# Altium project PCB_Concentrator.PrjPcb (part 2 of 3)

## Sheet 05_Inputs_28-35.SchDoc
size 594 x 420 mm; DocumentNumber: Входы сухой контакт; SheetNumber: 5; SheetTotal: 6
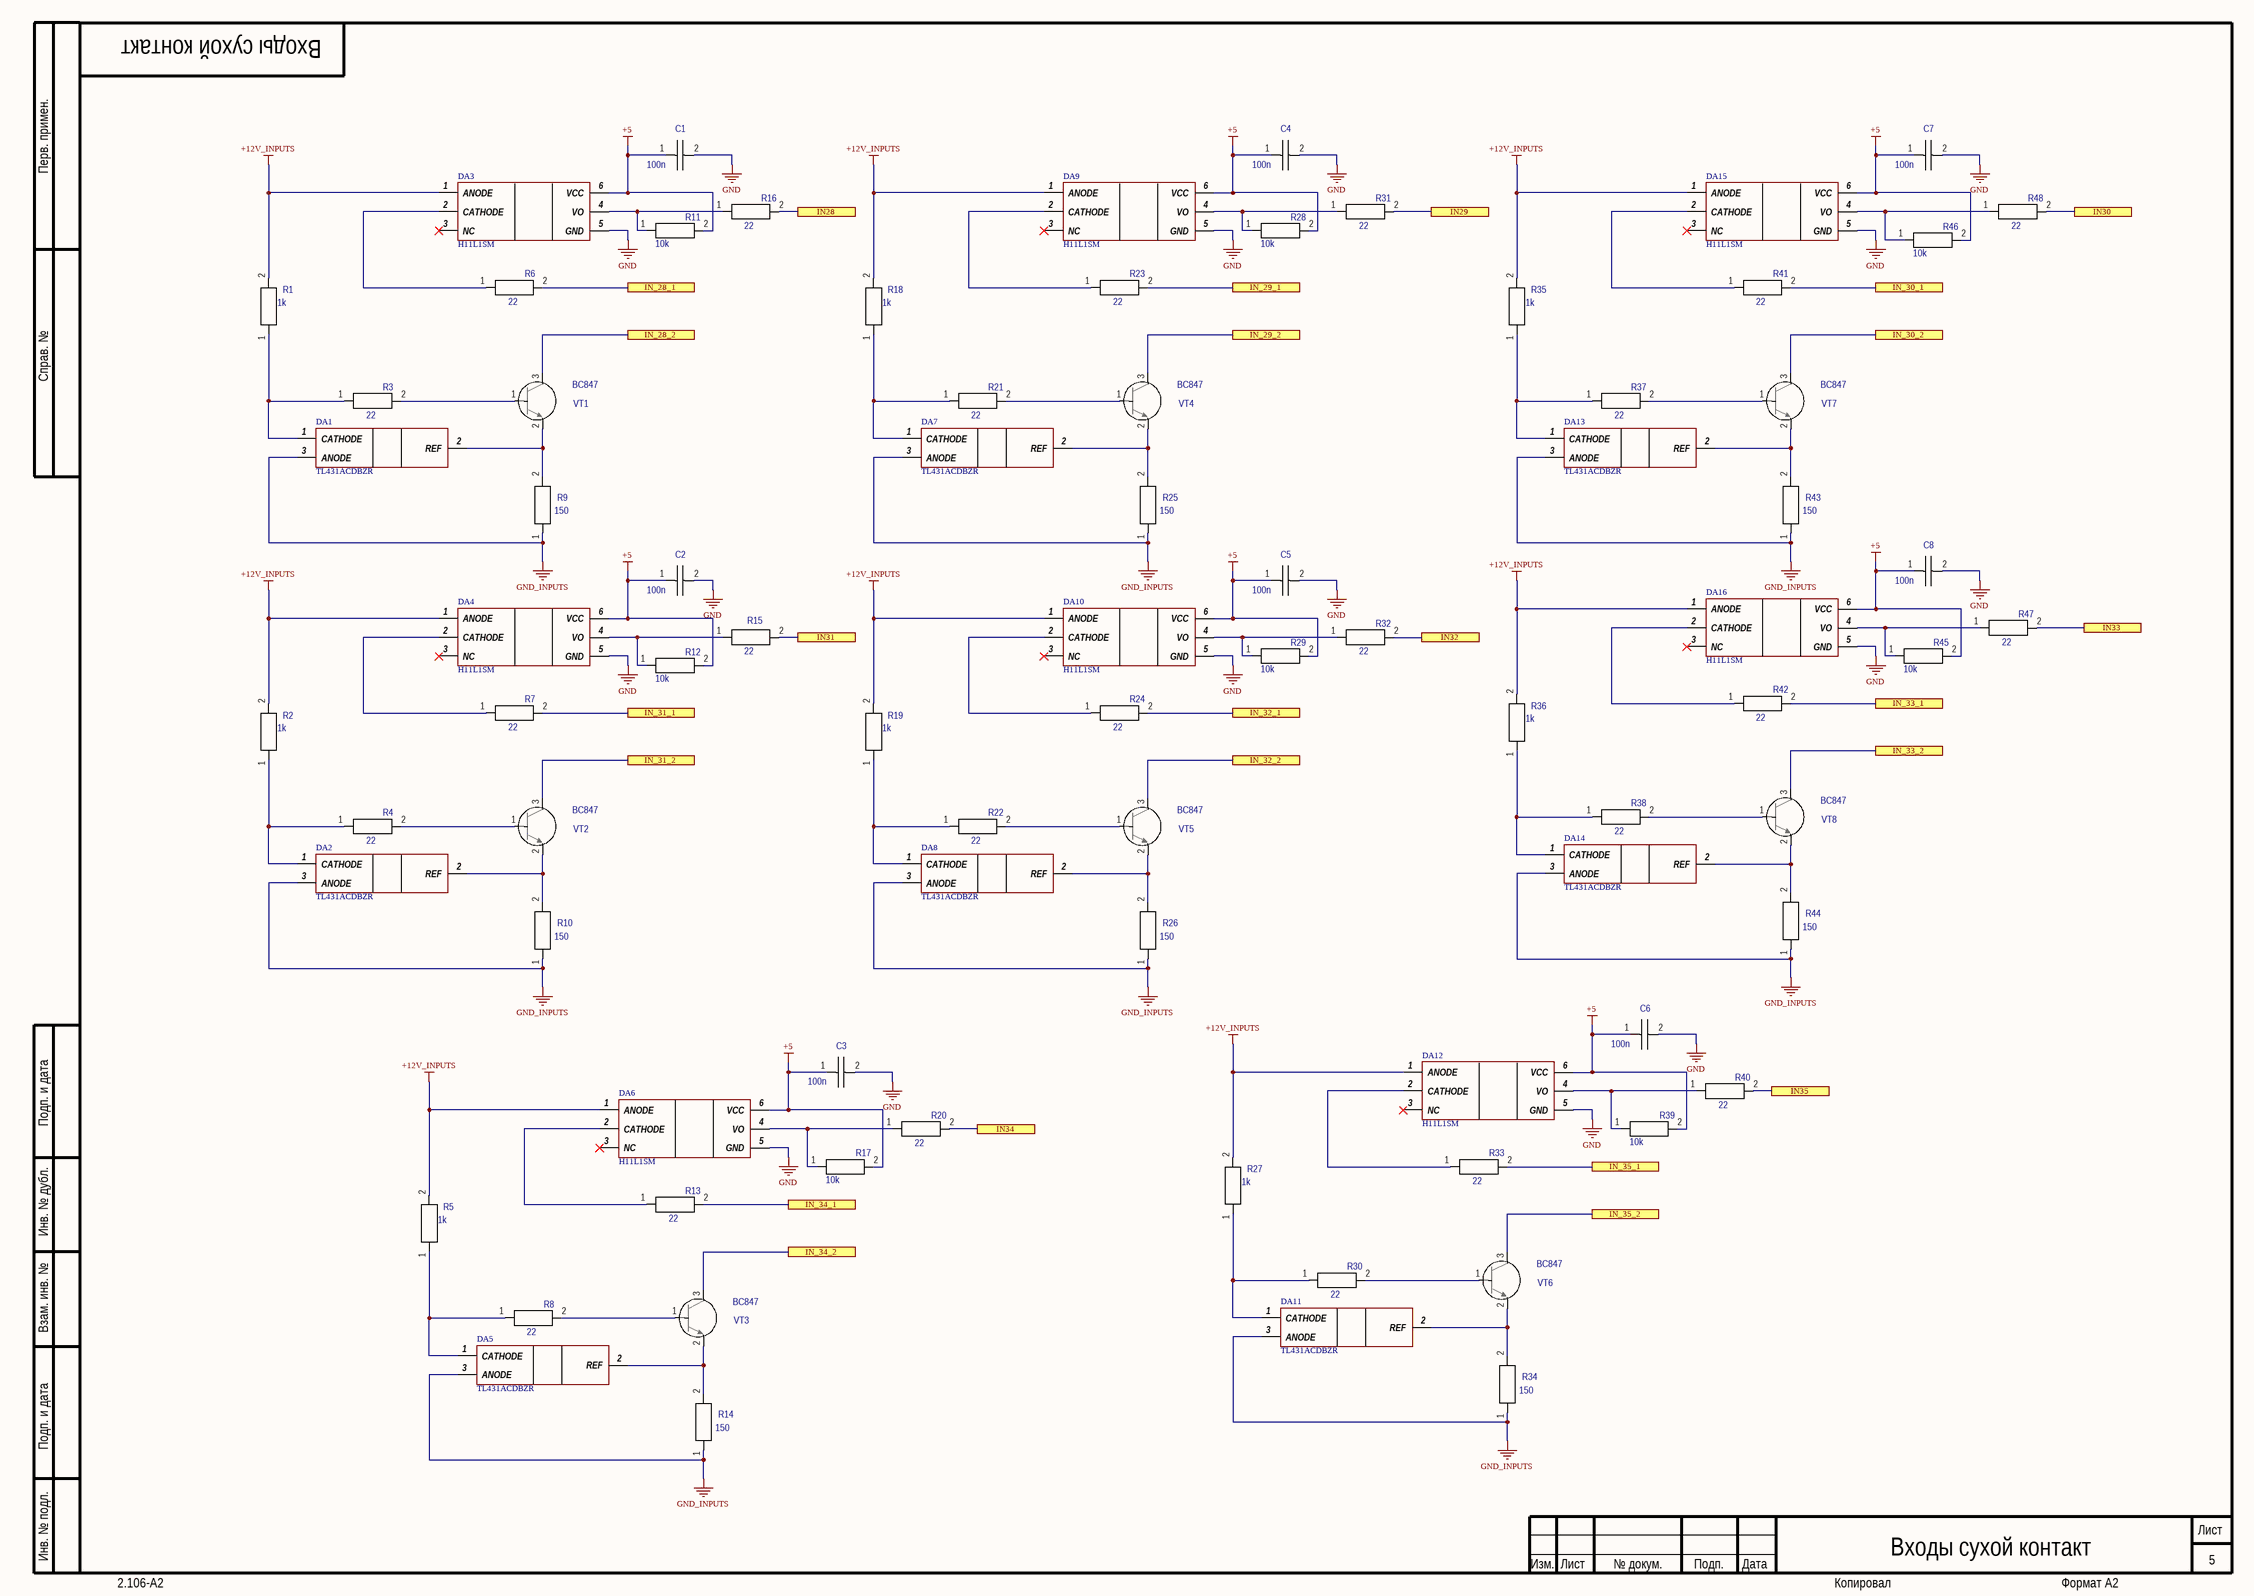
[diagram p7: 05_Inputs_28-35.SchDoc]

### Parts
C1  value 100n  [C0603]  (hidden comment: C0603)
C2  value 100n  [C0603]  (hidden comment: C0603)
C3  value 100n  [C0603]  (hidden comment: C0603)
C4  value 100n  [C0603]  (hidden comment: C0603)
C5  value 100n  [C0603]  (hidden comment: C0603)
C6  value 100n  [C0603]  (hidden comment: C0603)
C7  value 100n  [C0603]  (hidden comment: C0603)
C8  value 100n  [C0603]  (hidden comment: C0603)
DA1  TL431ACDBZR  [SOT95P237X112-3N]
DA2  TL431ACDBZR  [SOT95P237X112-3N]
DA3  H11L1SM  [SOP254P1030X460-6N]
DA4  H11L1SM  [SOP254P1030X460-6N]
DA5  TL431ACDBZR  [SOT95P237X112-3N]
DA6  H11L1SM  [SOP254P1030X460-6N]
DA7  TL431ACDBZR  [SOT95P237X112-3N]
DA8  TL431ACDBZR  [SOT95P237X112-3N]
DA9  H11L1SM  [SOP254P1030X460-6N]
DA10  H11L1SM  [SOP254P1030X460-6N]
DA11  TL431ACDBZR  [SOT95P237X112-3N]
DA12  H11L1SM  [SOP254P1030X460-6N]
DA13  TL431ACDBZR  [SOT95P237X112-3N]
DA14  TL431ACDBZR  [SOT95P237X112-3N]
DA15  H11L1SM  [SOP254P1030X460-6N]
DA16  H11L1SM  [SOP254P1030X460-6N]
R1  value 1k  [RESC1608N]  (hidden comment: R0603)
R2  value 1k  [RESC1608N]  (hidden comment: R0603)
R3  value 22  [RESC1608N]  (hidden comment: R0603)
R4  value 22  [RESC1608N]  (hidden comment: R0603)
R5  value 1k  [RESC1608N]  (hidden comment: R0603)
R6  value 22  [RESC1608N]  (hidden comment: R0603)
R7  value 22  [RESC1608N]  (hidden comment: R0603)
R8  value 22  [RESC1608N]  (hidden comment: R0603)
R9  value 150  [RESC1608N]  (hidden comment: R0603)
R10  value 150  [RESC1608N]  (hidden comment: R0603)
R11  value 10k  [RESC1608N]  (hidden comment: R0603)
R12  value 10k  [RESC1608N]  (hidden comment: R0603)
R13  value 22  [RESC1608N]  (hidden comment: R0603)
R14  value 150  [RESC1608N]  (hidden comment: R0603)
R15  value 22  [RESC1608N]  (hidden comment: R0603)
R16  value 22  [RESC1608N]  (hidden comment: R0603)
R17  value 10k  [RESC1608N]  (hidden comment: R0603)
R18  value 1k  [RESC1608N]  (hidden comment: R0603)
R19  value 1k  [RESC1608N]  (hidden comment: R0603)
R20  value 22  [RESC1608N]  (hidden comment: R0603)
R21  value 22  [RESC1608N]  (hidden comment: R0603)
R22  value 22  [RESC1608N]  (hidden comment: R0603)
R23  value 22  [RESC1608N]  (hidden comment: R0603)
R24  value 22  [RESC1608N]  (hidden comment: R0603)
R25  value 150  [RESC1608N]  (hidden comment: R0603)
R26  value 150  [RESC1608N]  (hidden comment: R0603)
R27  value 1k  [RESC1608N]  (hidden comment: R0603)
R28  value 10k  [RESC1608N]  (hidden comment: R0603)
R29  value 10k  [RESC1608N]  (hidden comment: R0603)
R30  value 22  [RESC1608N]  (hidden comment: R0603)
R31  value 22  [RESC1608N]  (hidden comment: R0603)
R32  value 22  [RESC1608N]  (hidden comment: R0603)
R33  value 22  [RESC1608N]  (hidden comment: R0603)
R34  value 150  [RESC1608N]  (hidden comment: R0603)
R35  value 1k  [RESC1608N]  (hidden comment: R0603)
R36  value 1k  [RESC1608N]  (hidden comment: R0603)
R37  value 22  [RESC1608N]  (hidden comment: R0603)
R38  value 22  [RESC1608N]  (hidden comment: R0603)
R39  value 10k  [RESC1608N]  (hidden comment: R0603)
R40  value 22  [RESC1608N]  (hidden comment: R0603)
R41  value 22  [RESC1608N]  (hidden comment: R0603)
R42  value 22  [RESC1608N]  (hidden comment: R0603)
R43  value 150  [RESC1608N]  (hidden comment: R0603)
R44  value 150  [RESC1608N]  (hidden comment: R0603)
R45  value 10k  [RESC1608N]  (hidden comment: R0603)
R46  value 10k  [RESC1608N]  (hidden comment: R0603)
R47  value 22  [RESC1608N]  (hidden comment: R0603)
R48  value 22  [RESC1608N]  (hidden comment: R0603)
VT1  BC847  [SOT23-3N]
VT2  BC847  [SOT23-3N]
VT3  BC847  [SOT23-3N]
VT4  BC847  [SOT23-3N]
VT5  BC847  [SOT23-3N]
VT6  BC847  [SOT23-3N]
VT7  BC847  [SOT23-3N]
VT8  BC847  [SOT23-3N]

### Ports
IN28, IN29, IN30, IN31, IN32, IN33, IN34, IN35, IN_28_1, IN_28_2, IN_29_1, IN_29_2, IN_30_1, IN_30_2, IN_31_1, IN_31_2, IN_32_1, IN_32_2, IN_33_1, IN_33_2, IN_34_1, IN_34_2, IN_35_1, IN_35_2

### Nets
+5: C1.1 C2.1 C3.1 C4.1 C5.1 C6.1 C7.1 C8.1 DA3.6(VCC) DA4.6(VCC) DA6.6(VCC) DA9.6(VCC) DA10.6(VCC) DA12.6(VCC) DA15.6(VCC) DA16.6(VCC) R11.2 R12.2 R17.2 R28.2 R29.2 R39.2 R45.2 R46.2
+12V_INPUTS: DA3.1(ANODE) DA4.1(ANODE) DA6.1(ANODE) DA9.1(ANODE) DA10.1(ANODE) DA12.1(ANODE) DA15.1(ANODE) DA16.1(ANODE) R1.2 R2.2 R5.2 R18.2 R19.2 R27.2 R35.2 R36.2
GND: C1.2 C2.2 C3.2 C4.2 C5.2 C6.2 C7.2 C8.2 DA3.5(GND) DA4.5(GND) DA6.5(GND) DA9.5(GND) DA10.5(GND) DA12.5(GND) DA15.5(GND) DA16.5(GND)
GND_INPUTS: DA1.3(ANODE) DA2.3(ANODE) DA5.3(ANODE) DA7.3(ANODE) DA8.3(ANODE) DA11.3(ANODE) DA13.3(ANODE) DA14.3(ANODE) R9.1 R10.1 R14.1 R25.1 R26.1 R34.1 R43.1 R44.1
55: R6.2 ; port IN_28_1
56: VT1.3 ; port IN_28_2
57: R23.2 ; port IN_29_1
58: VT4.3 ; port IN_29_2
59: R41.2 ; port IN_30_1
60: VT7.3 ; port IN_30_2
61: R7.2 ; port IN_31_1
62: VT2.3 ; port IN_31_2
63: R24.2 ; port IN_32_1
64: VT5.3 ; port IN_32_2
65: R42.2 ; port IN_33_1
66: VT8.3 ; port IN_33_2
67: R13.2 ; port IN_34_1
68: VT3.3 ; port IN_34_2
69: R33.2 ; port IN_35_1
70: VT6.3 ; port IN_35_2
NetDA1_1: DA1.1(CATHODE) R1.1 R3.1
NetDA1_2: DA1.2(REF) R9.2 VT1.2
NetDA2_1: DA2.1(CATHODE) R2.1 R4.1
NetDA2_2: DA2.2(REF) R10.2 VT2.2
NetDA3_2: DA3.2(CATHODE) R6.1
NetDA3_4: DA3.4(VO) R11.1 R16.1
NetDA4_2: DA4.2(CATHODE) R7.1
NetDA4_4: DA4.4(VO) R12.1 R15.1
NetDA5_1: DA5.1(CATHODE) R5.1 R8.1
NetDA5_2: DA5.2(REF) R14.2 VT3.2
NetDA6_2: DA6.2(CATHODE) R13.1
NetDA6_4: DA6.4(VO) R17.1 R20.1
NetDA7_1: DA7.1(CATHODE) R18.1 R21.1
NetDA7_2: DA7.2(REF) R25.2 VT4.2
NetDA8_1: DA8.1(CATHODE) R19.1 R22.1
NetDA8_2: DA8.2(REF) R26.2 VT5.2
NetDA9_2: DA9.2(CATHODE) R23.1
NetDA9_4: DA9.4(VO) R28.1 R31.1
NetDA10_2: DA10.2(CATHODE) R24.1
NetDA10_4: DA10.4(VO) R29.1 R32.1
NetDA11_1: DA11.1(CATHODE) R27.1 R30.1
NetDA11_2: DA11.2(REF) R34.2 VT6.2
NetDA12_2: DA12.2(CATHODE) R33.1
NetDA12_4: DA12.4(VO) R39.1 R40.1
NetDA13_1: DA13.1(CATHODE) R35.1 R37.1
NetDA13_2: DA13.2(REF) R43.2 VT7.2
NetDA14_1: DA14.1(CATHODE) R36.1 R38.1
NetDA14_2: DA14.2(REF) R44.2 VT8.2
NetDA15_2: DA15.2(CATHODE) R41.1
NetDA15_4: DA15.4(VO) R46.1 R48.1
NetDA16_2: DA16.2(CATHODE) R42.1
NetDA16_4: DA16.4(VO) R45.1 R47.1
NetR3_2: R3.2 VT1.1
NetR4_2: R4.2 VT2.1
NetR8_2: R8.2 VT3.1
NetR15_2: R15.2 ; port IN31
NetR16_2: R16.2 ; port IN28
NetR20_2: R20.2 ; port IN34
NetR21_2: R21.2 VT4.1
NetR22_2: R22.2 VT5.1
NetR30_2: R30.2 VT6.1
NetR31_2: R31.2 ; port IN29
NetR32_2: R32.2 ; port IN32
NetR37_2: R37.2 VT7.1
NetR38_2: R38.2 VT8.1
NetR40_2: R40.2 ; port IN35
NetR47_2: R47.2 ; port IN33
NetR48_2: R48.2 ; port IN30

Not connected (* = marked no-connect by the designer): DA3 3(NC)*; DA4 3(NC)*; DA6 3(NC)*; DA9 3(NC)*; DA10 3(NC)*; DA12 3(NC)*; DA15 3(NC)*; DA16 3(NC)*

### Notes on the sheet
- Перв. примен.
- Справ. №
- Подп. и дата
- Инв. № дубл.
- Взам. инв. №
- Инв. № подл.
- Изм.
- Лист
- № докум.
- Подп.
- Дата
- 2.106-A2
- Копировал
- Формат А2

### Library data of the parts
C1-C8 = GRM188R71C104KA01D: as C9 on sheet 02_Inputs_1-9; Comments: C0603; Part Number: GRM188R71C104KA01D; Height: 0.9; Package: C0603; TemperatureMin: -55; TemperatureMax: 125
DA1 DA2 DA5 DA7 DA8 DA11 DA13 DA14 = TL431ACDBZR: Integrated Circuit; Manufacturer_Name: Texas Instruments; Datasheet Link: https://datasheet.datasheetarchive.com/originals/distributors/SFDatasheet-6/sf-000131849.pdf; Manufacturer_Part_Number: TL431ACDBZR; Mouser Part Number: 595-TL431ACDBZR; Mouser Price/Stock: https://www.mouser.co.uk/ProductDetail/Texas-Instruments/TL431ACDBZR?qs=odmYgEirbwzMcBuFx%2Fo8hQ%3D%3D; Arrow Part Number: TL431ACDBZR; Arrow Price/Stock: https://www.arrow.com/en/products/tl431acdbzr/texas-instruments?region=nac; PartNumber: TL431ACDBZR
DA3 DA4 DA6 DA9 DA10 DA12 DA15 DA16 = H11L1SM: Integrated Circuit; Manufacturer_Name: Iso Com; Datasheet Link: http://isocom.com/wp-content/uploads/2017/09/DD93224-H11L1_H11L1V-110817.pdf; Height: 4.6mm; Manufacturer_Part_Number: H11L1SM; PartNumber: H11L1SM
R1 R2 R5 R18 R19 R27 R35 R36 = RC0603FK-071KL: Manufacturer: Тайвань; Код: 31; ID: Резистор; Power/Voltage: 0.063W/50V; Tolerance: ±1%; iii: Резистор RC0603FK-071KL 1k 0.063W/50V ±1% R0603  Тайвань; Comments: R0603; Part Number: RC0603FK-071KL; Package: R0603; TemperatureMin: -55; TemperatureMax: 155
R3 R4 R6-R8 R13 R15 R16 R20-R24 R30-R33 R37 R38 R40-R42 R47 R48 = RC0603FK-0722RL: as R52 on sheet 02_Inputs_1-9; Comments: R0603; Part Number: RC0603FK-0722RL; Package: R0603; TemperatureMin: -55; TemperatureMax: 155
R9 R10 R14 R25 R26 R34 R43 R44 = RC0603FK-07150RL: Manufacturer: Тайвань; Код: 17; ID: Резистор; Power/Voltage: 0.063W/50V; Tolerance: ±1%; iii: Резистор RC0603FK-07150RL 150 0.063W/50V ±1% R0603  Тайвань; Comments: R0603; Part Number: RC0603FK-07150RL; Package: R0603; TemperatureMin: -55; TemperatureMax: 155
R11 R12 R17 R28 R29 R39 R45 R46 = RC0603FK-0710KL: as R61 on sheet 02_Inputs_1-9; Comments: R0603; Package: R0603; TemperatureMin: -55; TemperatureMax: 155
VT1-VT8 = BC847: as VT9 on sheet 02_Inputs_1-9; Com: BC847; Part Number: BC847; Package: sot23

## Sheet 07_RS485.SchDoc: RS485
size 420 x 297 mm; Author: Ульянов А.В.; Address1: Address1; Address2: Address2; Address3: Address3; Address4: Address4; DocumentNumber: RS485 ISO; SheetNumber: 6; SheetTotal: 11; Scale: 1:1; Title2str: Изолированный; DocumentType: Схема электрическая принципиальная; FirstReferrence: АБВГ.123456.001
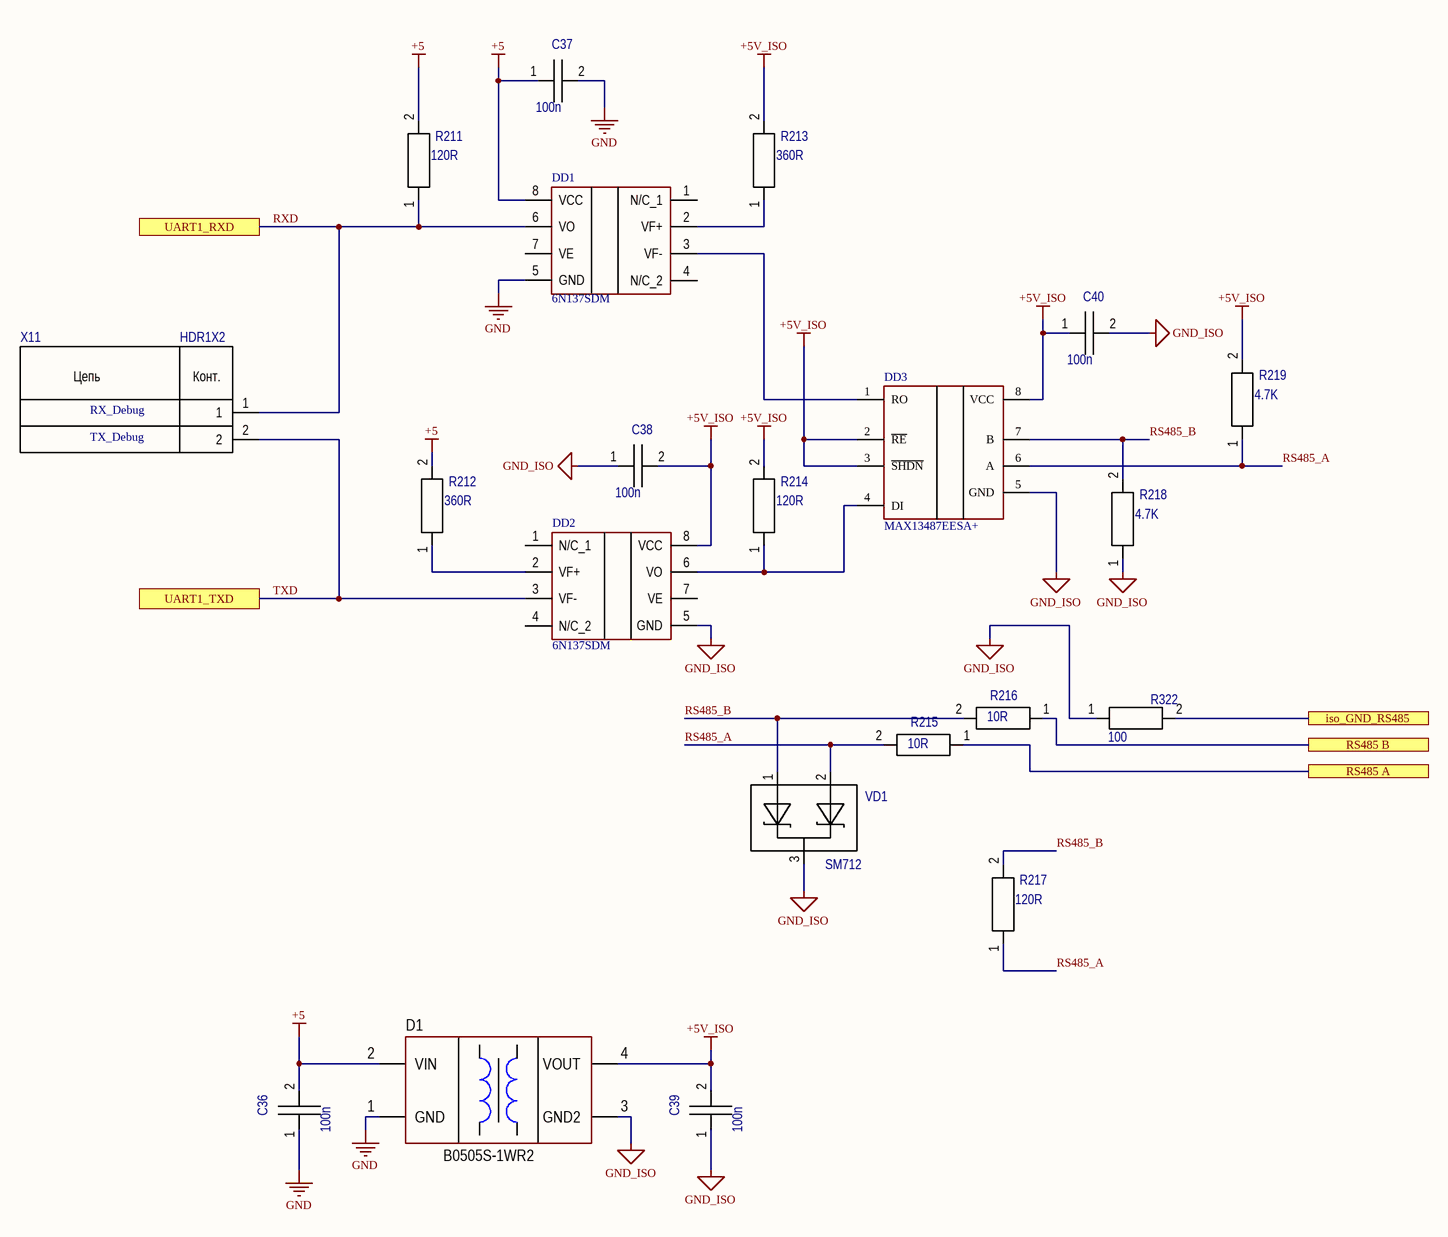
[diagram p8: 07_RS485.SchDoc]

### Parts
C36  value 100n  [C0603]  (hidden comment: C0603)
C37  value 100n  [C0603]  (hidden comment: C0603)
C38  value 100n  [C0603]  (hidden comment: C0603)
C39  value 100n  [C0603]  (hidden comment: C0603)
C40  value 100n  [C0603]  (hidden comment: C0603)
D1  (no value)  [MOD: SIP-4 (B0505S-1W)]
DD1  6N137SDM  [SOP254P1030X508-8N]
DD2  6N137SDM  [SOP254P1030X508-8N]
DD3  MAX13487EESA+  [SOIC127P600X175-8N]
R211  value 120R  [RESC1608N]  (hidden comment: R0603)
R212  value 360R  [RESC1608N]  (hidden comment: R0603)
R213  value 360R  [RESC1608N]  (hidden comment: R0603)
R214  value 120R  [RESC1608N]  (hidden comment: R0603)
R215  value 10R  [RESC1608N]  (hidden comment: R0603)
R216  value 10R  [RESC1608N]  (hidden comment: R0603)
R217  value 120R  [RESC1608N]  (hidden comment: R0603)
R218  value 4.7K  [RESC1608N]  (hidden comment: R0603)
R219  value 4.7K  [RESC1608N]  (hidden comment: R0603)
R322  value 100  [RESC3216N]  (hidden comment: R1206)
VD1  SM712  [SOT23-3N]
X11  HDR1X2  [HDR1X2]

### Ports
iso_GND_RS485, RS485 A, RS485 B, UART1_RXD, UART1_TXD

### Nets
+5: C36.2 C37.1 D1.2(VIN) DD1.8(VCC) R211.2 R212.2
+5V_ISO: C38.2 C39.2 C40.1 D1.4(VOUT) DD2.8(VCC) DD3.2(~{RE}) DD3.3(~{SHDN}) DD3.8(VCC) R213.2 R214.2 R219.2
GND: C36.1 C37.2 D1.1(GND) DD1.5(GND)
GND_ISO: C38.1 C39.1 C40.2 D1.3(GND2) DD2.5(GND) DD3.5(GND) R218.1 R322.1 VD1.3
71: R215.1 ; port RS485 A
72: R216.1 ; port RS485 B
73: R322.2 ; port iso_GND_RS485
RS485_A: DD3.6(A) R215.2 R217.1 R219.1 VD1.2
RS485_B: DD3.7(B) R216.2 R217.2 R218.2 VD1.1
RXD: DD1.6(VO) R211.1 X11.1 ; port UART1_RXD
TXD: DD2.3(VF-) X11.2 ; port UART1_TXD
NetDD1_2: DD1.2(VF+) R213.1
NetDD1_3: DD1.3(VF-) DD3.1(RO)
NetDD2_2: DD2.2(VF+) R212.1
NetDD2_6: DD2.6(VO) DD3.4(DI) R214.1

Not connected (* = marked no-connect by the designer): DD1 1(N/C_1) 4(N/C_2) 7(VE); DD2 1(N/C_1) 4(N/C_2) 7(VE)

### Notes on the sheet
- RX_Debug
- TX_Debug
- Подп. и дата
- Инв. № дубл.
- Взам. инв. №
- Инв. № подл.
- Изм.
- Лист
- № докум.
- Подп.
- Дата
- 2.106-A3
- Копировал
- Формат А3
- (in symbol HDR1X2) Цепь; Конт.

### Library data of the parts
C36-C40 = GRM188R72A104KA35D: Manufacturer: Murata Manufacturing; Код: 24; ID: Конденсатор; Power/Voltage: 100V; Tolerance: ±10%; TKE: X7R; iii: Конденсатор GRM188R72A104KA35D 100n 100V ±10% C0603 X7R  Murata Manufacturing; Comments: C0603; Part Number: GRM188R72A104KA35D; Height: 0.9; Package: C0603; TemperatureMin: -55; TemperatureMax: 125
D1 = B0505S-1WR2: DC/DC converter; Manufacturer: Mornsun; ValueManufacturerPartNumber: DC/DC converter, isolator, 5V 200mA, -40...+105°C, SIP-4; OutputType: isolator; OutputVoltage: 5V 200mA; HelpURL: https://www.chipdip.ru/product/b0505s-1wr2; Package: SIP-4; ComponentType: DC/DC converter; Temperature: -40...+105°C; PartNumber: B0505S-1WR2
DD1 DD2 = 6N137SDM: Integrated Circuit; Manufacturer_Name: ON Semiconductor; Datasheet Link: https://www.onsemi.com/pub/Collateral/HCPL2631M-D.pdf; Height: 5.08mm; PartNumber: 6N137SDM; Mouser Part Number: 512-6N137SDM; Mouser Price/Stock: https://www.mouser.co.uk/ProductDetail/ON-Semiconductor-Fairchild/6N137SDM?qs=wuRI32rFNSFC%252BTbDLj3kvw%3D%3D; Arrow Part Number: 6N137SDM; Arrow Price/Stock: https://www.arrow.com/en/products/6n137sdm/on-semiconductor?region=nac
DD3 = MAX13487EESA+: Integrated Circuit; Manufacturer_Name: Maxim Integrated; Datasheet Link: http://docs-emea.rs-online.com/webdocs/13e4/0900766b813e41ed.pdf; Height: 1.75mm; PartNumber: MAX13487EESA+; Mouser Part Number: 700-MAX13487EESA; Mouser Price/Stock: https://www.mouser.co.uk/ProductDetail/Maxim-Integrated/MAX13487EESA%2b?qs=1THa7WoU59G338ZrcGWwYw%3D%3D
R211 R214 R217 = RC0603FK-0710KL: Part Number: RC0603FR-07120RL; Manufacturer: Тайвань; Код: 26; ID: Резистор; Power/Voltage: 0.063W/50V; Tolerance: ±1%; iii: Резистор RC0603FK-0710KL 10k 0.063W/50V ±1% R0603  Тайвань; Comments: R0603; Package: R0603; TemperatureMin: -55; TemperatureMax: 155
R212 R213 = RC0603FK-0710KL: Part Number: RC0603FR-07360RL; Manufacturer: Тайвань; Код: 26; ID: Резистор; Power/Voltage: 0.063W/50V; Tolerance: ±1%; iii: Резистор RC0603FK-0710KL 10k 0.063W/50V ±1% R0603  Тайвань; Comments: R0603; Package: R0603; TemperatureMin: -55; TemperatureMax: 155
R215 R216 = RC0603FK-0710KL: Part Number: RC0603FR-0710RL; Manufacturer: Тайвань; Код: 26; ID: Резистор; Power/Voltage: 0.063W/50V; Tolerance: ±1%; iii: Резистор RC0603FK-0710KL 10k 0.063W/50V ±1% R0603  Тайвань; Comments: R0603; Package: R0603; TemperatureMin: -55; TemperatureMax: 155
R218 R219 = RC0603FK-0710KL: Part Number: RC0603FR-074K7L; Manufacturer: Тайвань; Код: 26; ID: Резистор; Power/Voltage: 0.063W/50V; Tolerance: ±1%; iii: Резистор RC0603FK-0710KL 10k 0.063W/50V ±1% R0603  Тайвань; Comments: R0603; Package: R0603; TemperatureMin: -55; TemperatureMax: 155
R322 = RC1206FR-070R33L: Part Number: RC1206FR-07100RL; Код: 196; ID: Резистор; Power/Voltage: 0.25W; Tolerance: ±1%; Comments: R1206; Package: R1206; iii: RC1206FR-07100RL
VD1 = SM712.TCT: Manufacturer: Semtech; Код: 32; ID: Защитный диод 2 канальный; Power/Voltage: 12V/400W; iii: Защитный диод 2 канальный SM712.TCT  12V/400W  SOT-23  Semtech; Com: SM712; Part Number: SM712.TCT; Package: SOT-23; TemperatureMin: -55; TemperatureMax: 125
X11 = HDR1X2: Manufacturer: Dinkle Enterprise; Код: 12; ID: Коннектор; iii: Коннектор HDR1X2      Dinkle Enterprise; Part Number: HDR1X2

## Sheet 06_PWR_Inputs_12V.SchDoc
size 209 x 297 mm; DocumentNumber: Питание входов; SheetNumber: 7; SheetTotal: 11
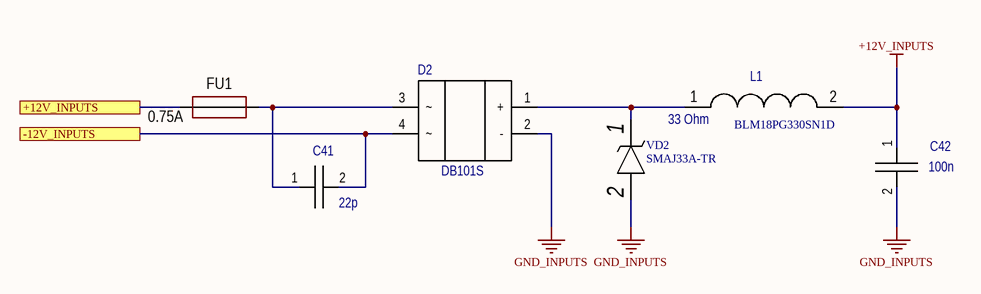
[diagram p9: 06_PWR_Inputs_12V.SchDoc]

### Parts
C41  value 22p  [C0603]  (hidden comment: C0603)
C42  value 100n  [C0603]  (hidden comment: C0603)
D2  DB101S  [DB-1S]
FU1  MaxCurrent: 0.75A  [FUSE: 1206]
L1  BLM18PG330SN1D  value 33 Ohm  [INDC1608N]
VD2  SMAJ33A-TR  [SM4T82AY]

### Ports
+12V_INPUTS, -12V_INPUTS

### Nets
+12V_INPUTS: C42.1 L1.2
GND_INPUTS: C42.2 D2.2(-) VD2.2(A)
74: FU1.1 ; port +12V_INPUTS
75: C41.2 D2.4 ; port -12V_INPUTS
NetC41_1: C41.1 D2.3 FU1.2
NetD2_1: D2.1(+) L1.1 VD2.1(K)

### Notes on the sheet
- Подп. и дата
- Инв. № дубл.
- Взам. инв. №
- Инв. № подл.
- Изм.
- Лист
- № докум.
- Подп.
- Дата
- Форма 2а ГОСТ 2.104-2006
- Копировал
- Формат А4

### Library data of the parts
C41 = GRM1885C1H220JA01D: Manufacturer: Murata Manufacturing; Код: 80; ID: Конденсатор; Power/Voltage: 50V; Tolerance: ±5%; TKE: c0g; iii: Конденсатор GRM1885C1H220JA01D 22p 50V ±5% C0603 c0g Murata Manufacturing; Comments: C0603; Part Number: GRM1885C1H220JA01D; Package: C0603; TemperatureMin: -55; TemperatureMax: 125
C42 = GRM188R71E104KA01D: Manufacturer: Murata Manufacturing; Код: 23; ID: Конденсатор; Power/Voltage: 25V; Tolerance: ±10%; TKE: X7R; iii: Конденсатор GRM188R71E104KA01D 100n 25V ±10% C0603 X7R  Murata Manufacturing; Comments: C0603; Part Number: GRM188R71E104KA01D; Height: 0.9; Package: C0603; TemperatureMin: -55; TemperatureMax: 125
D2 = DB101S: SINGLE-PHASE SURFACE MOUNT BRIDGE RECTIFIER; Manufacturer: DC COMPONENTS; Код: 5; ID: Диодный мост; Value: 1A; Power/Voltage: 50V; iii: Диодный мост DB101S 1A 50V    DC COMPONENTS; Com: DB101S; Part Number: DB101S; ComponentLink1Description: Datasheet; ComponentLink1URL: \\server_altium\ServerShare\Schematic\pdf\DB101S.pdf; TemperatureMin: -55; TemperatureMax: 150
FU1 = Fuse: Manufacturer: 1206-13V-075A-1; VoltageMax: 13; Package: 1206; ValueManufacturerPartNumber: =TypeFuse+', '+VoltageMax+', '+MaxCurrent+', '+Package+', '+Temperature; PartNumber: 1206-13V-075A-1
L1 = BLM18PG330SN1D: Код: 22; ID: Ферритовая бусина; Power/Voltage: 3A; iii: Ферритовая бусина BLM18PG330SN1D 33 Ohm 3A  L0603; Com: BLM18PG330SN1D; Part Number: BLM18PG330SN1D; Package: L0603
VD2 = SMAJ33A-TR: TVS Diode (Uni-directional); Manufacturer_Name: STMicroelectronics; Datasheet Link: https://www.st.com/resource/en/datasheet/smaj10ca.pdf; Height: 2.65mm; PartNumber: SMAJ33A-TR; Mouser Part Number: 511-SMAJ33A-TR; Mouser Price/Stock: https://www.mouser.co.uk/ProductDetail/STMicroelectronics/SMAJ33A-TR?qs=jwZhmErakJAmVBO%2Fr9%252BXpg%3D%3D; Arrow Part Number: SMAJ33A-TR; Arrow Price/Stock: https://www.arrow.com/en/products/smaj33a-tr/stmicroelectronics?region=europe

## Sheet 08_Extention_GPIO.SchDoc
size 420 x 297 mm; DocumentNumber: Расширитель порта; SheetNumber: 8; SheetTotal: 11
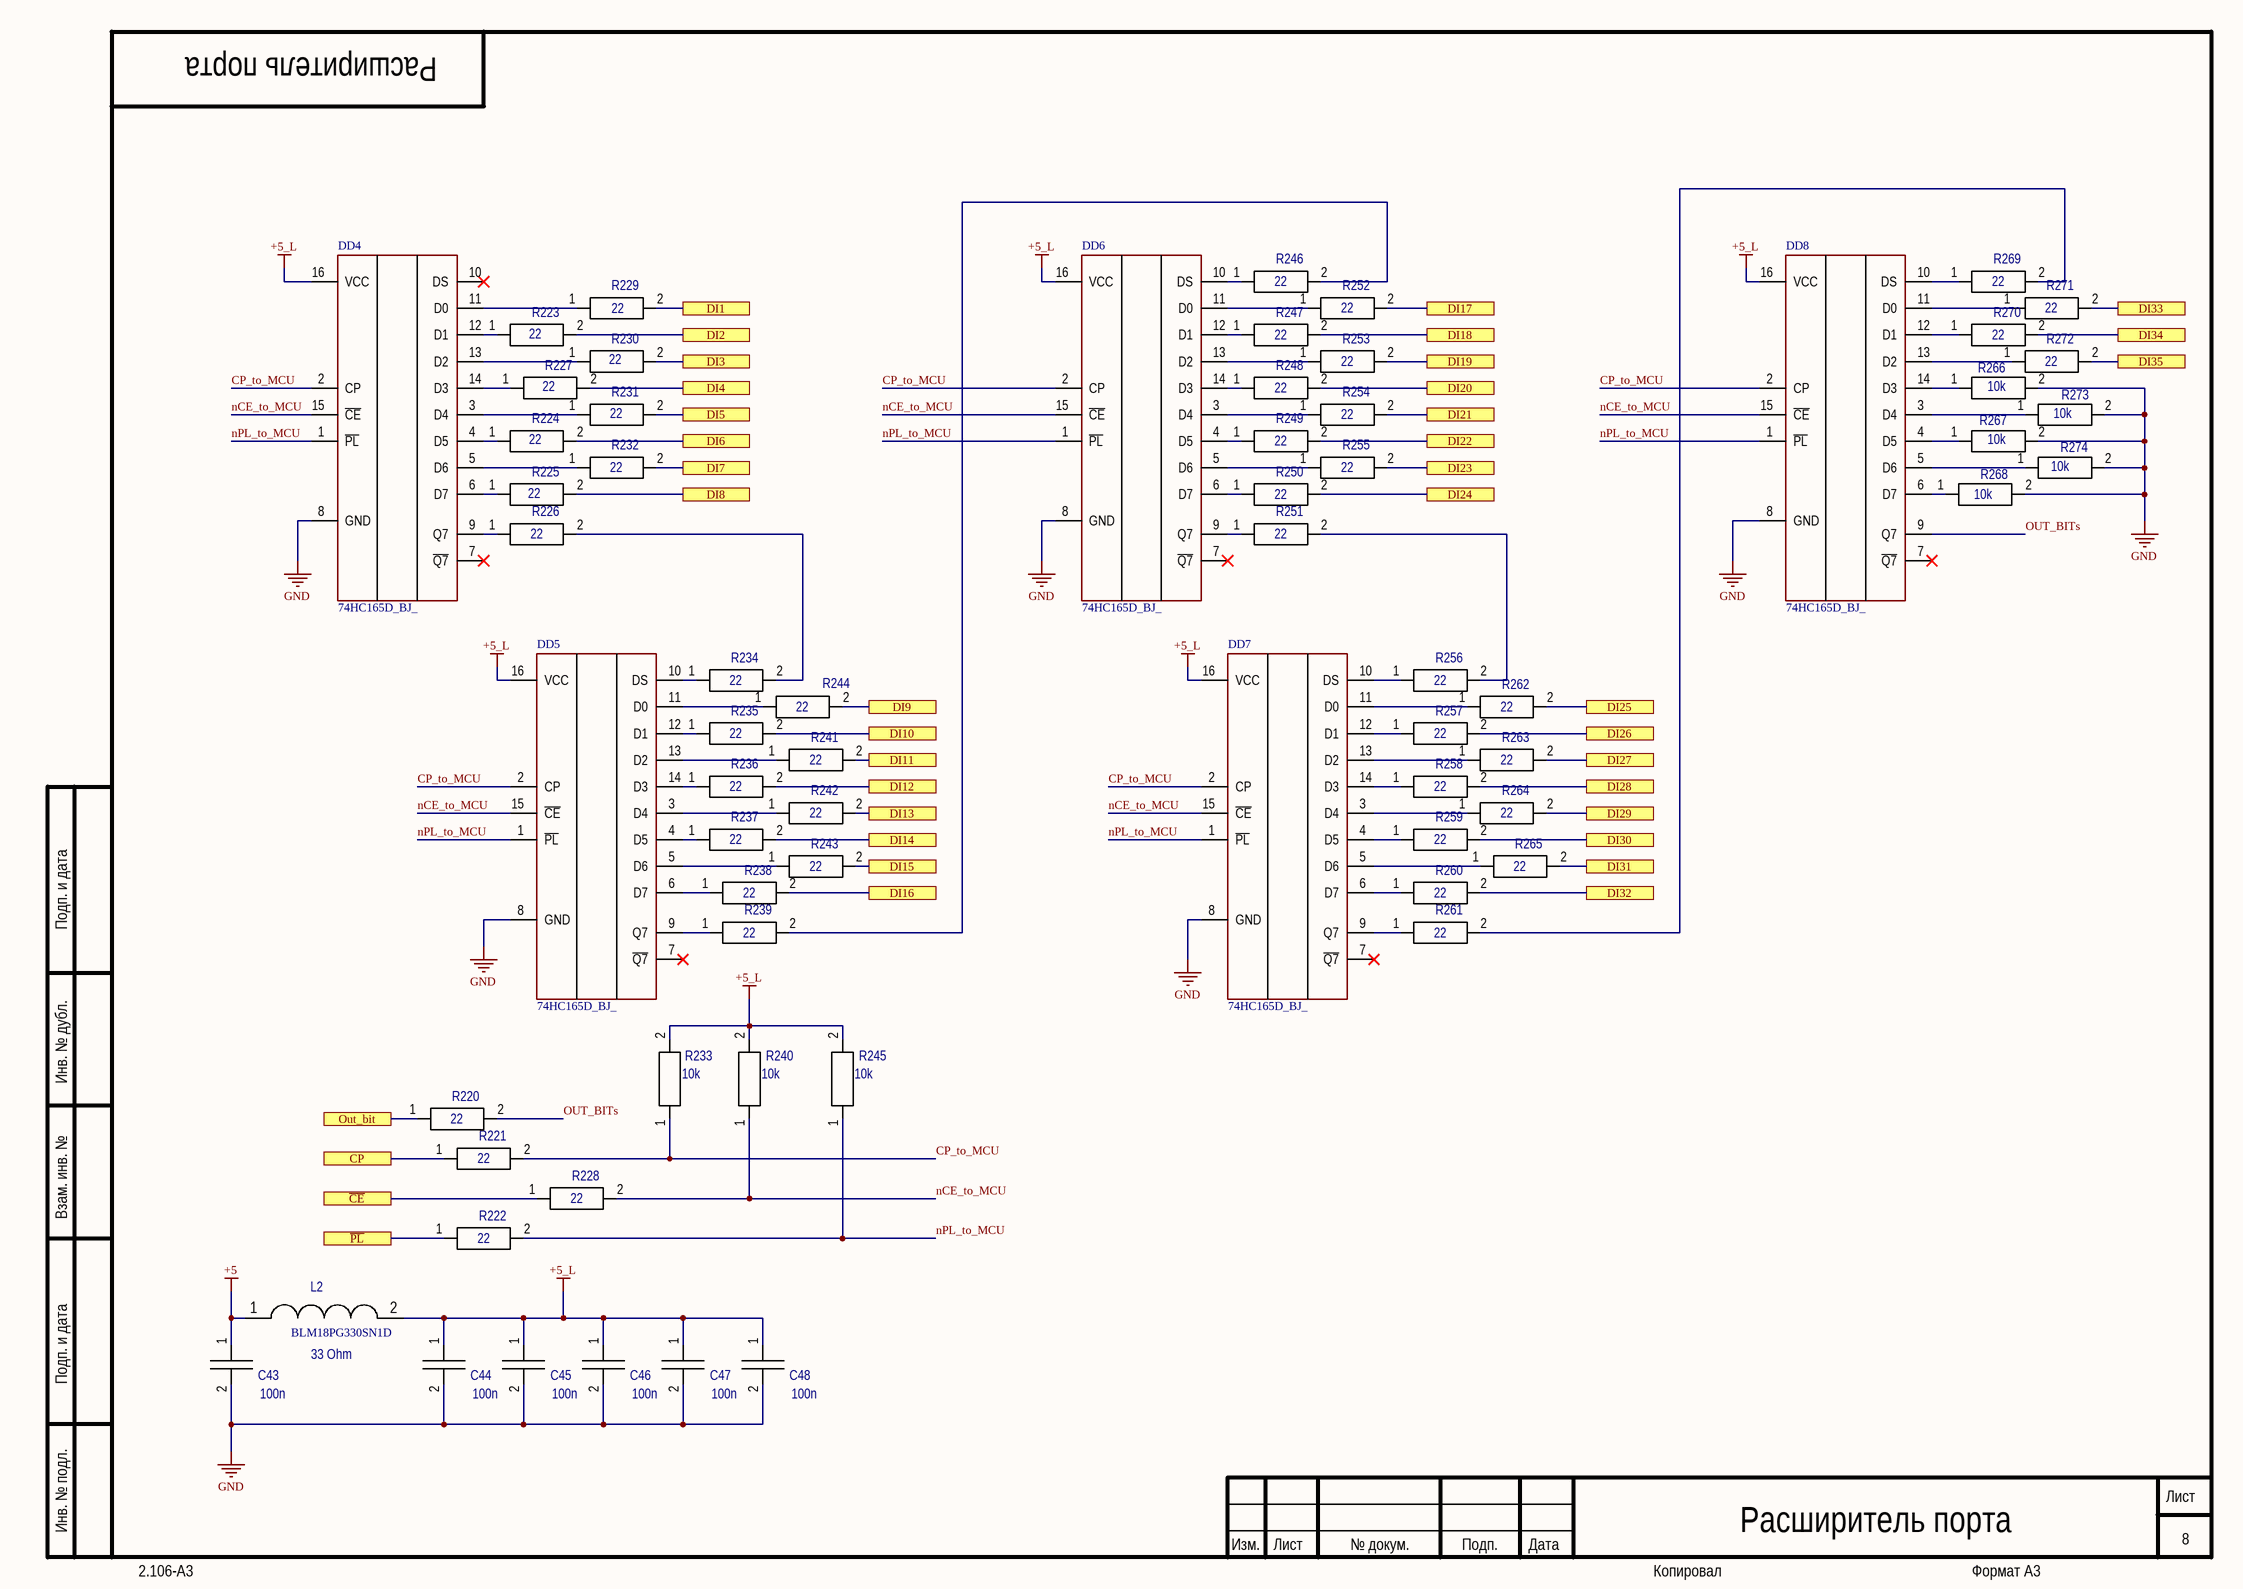
[diagram p10: 08_Extention_GPIO.SchDoc]

### Parts
C43  value 100n  [C0603]  (hidden comment: C0603)
C44  value 100n  [C0603]  (hidden comment: C0603)
C45  value 100n  [C0603]  (hidden comment: C0603)
C46  value 100n  [C0603]  (hidden comment: C0603)
C47  value 100n  [C0603]  (hidden comment: C0603)
C48  value 100n  [C0603]  (hidden comment: C0603)
DD4  74HC165D_BJ_  [SOIC127P600X175-16N]
DD5  74HC165D_BJ_  [SOIC127P600X175-16N]
DD6  74HC165D_BJ_  [SOIC127P600X175-16N]
DD7  74HC165D_BJ_  [SOIC127P600X175-16N]
DD8  74HC165D_BJ_  [SOIC127P600X175-16N]
L2  BLM18PG330SN1D  value 33 Ohm  [INDC1608N]
R220  value 22  [RESC1608N]  (hidden comment: R0603)
R221  value 22  [RESC1608N]  (hidden comment: R0603)
R222  value 22  [RESC1608N]  (hidden comment: R0603)
R223  value 22  [RESC1608N]  (hidden comment: R0603)
R224  value 22  [RESC1608N]  (hidden comment: R0603)
R225  value 22  [RESC1608N]  (hidden comment: R0603)
R226  value 22  [RESC1608N]  (hidden comment: R0603)
R227  value 22  [RESC1608N]  (hidden comment: R0603)
R228  value 22  [RESC1608N]  (hidden comment: R0603)
R229  value 22  [RESC1608N]  (hidden comment: R0603)
R230  value 22  [RESC1608N]  (hidden comment: R0603)
R231  value 22  [RESC1608N]  (hidden comment: R0603)
R232  value 22  [RESC1608N]  (hidden comment: R0603)
R233  value 10k  [RESC1608N]  (hidden comment: R0603)
R234  value 22  [RESC1608N]  (hidden comment: R0603)
R235  value 22  [RESC1608N]  (hidden comment: R0603)
R236  value 22  [RESC1608N]  (hidden comment: R0603)
R237  value 22  [RESC1608N]  (hidden comment: R0603)
R238  value 22  [RESC1608N]  (hidden comment: R0603)
R239  value 22  [RESC1608N]  (hidden comment: R0603)
R240  value 10k  [RESC1608N]  (hidden comment: R0603)
R241  value 22  [RESC1608N]  (hidden comment: R0603)
R242  value 22  [RESC1608N]  (hidden comment: R0603)
R243  value 22  [RESC1608N]  (hidden comment: R0603)
R244  value 22  [RESC1608N]  (hidden comment: R0603)
R245  value 10k  [RESC1608N]  (hidden comment: R0603)
R246  value 22  [RESC1608N]  (hidden comment: R0603)
R247  value 22  [RESC1608N]  (hidden comment: R0603)
R248  value 22  [RESC1608N]  (hidden comment: R0603)
R249  value 22  [RESC1608N]  (hidden comment: R0603)
R250  value 22  [RESC1608N]  (hidden comment: R0603)
R251  value 22  [RESC1608N]  (hidden comment: R0603)
R252  value 22  [RESC1608N]  (hidden comment: R0603)
R253  value 22  [RESC1608N]  (hidden comment: R0603)
R254  value 22  [RESC1608N]  (hidden comment: R0603)
R255  value 22  [RESC1608N]  (hidden comment: R0603)
R256  value 22  [RESC1608N]  (hidden comment: R0603)
R257  value 22  [RESC1608N]  (hidden comment: R0603)
R258  value 22  [RESC1608N]  (hidden comment: R0603)
R259  value 22  [RESC1608N]  (hidden comment: R0603)
R260  value 22  [RESC1608N]  (hidden comment: R0603)
R261  value 22  [RESC1608N]  (hidden comment: R0603)
R262  value 22  [RESC1608N]  (hidden comment: R0603)
R263  value 22  [RESC1608N]  (hidden comment: R0603)
R264  value 22  [RESC1608N]  (hidden comment: R0603)
R265  value 22  [RESC1608N]  (hidden comment: R0603)
R266  value 10k  [RESC1608N]  (hidden comment: R0603)
R267  value 10k  [RESC1608N]  (hidden comment: R0603)
R268  value 10k  [RESC1608N]  (hidden comment: R0603)
R269  value 22  [RESC1608N]  (hidden comment: R0603)
R270  value 22  [RESC1608N]  (hidden comment: R0603)
R271  value 22  [RESC1608N]  (hidden comment: R0603)
R272  value 22  [RESC1608N]  (hidden comment: R0603)
R273  value 10k  [RESC1608N]  (hidden comment: R0603)
R274  value 10k  [RESC1608N]  (hidden comment: R0603)

### Ports
CP, DI1, DI2, DI3, DI4, DI5, DI6, DI7, DI8, DI9, DI10, DI11, DI12, DI13, DI14, DI15, DI16, DI17, DI18, DI19, DI20, DI21, DI22, DI23, DI24, DI25, DI26, DI27, DI28, DI29, DI30, DI31, DI32, DI33, DI34, DI35, Out_bit, ~{CE}, ~{PL}

### Nets
+5: C43.1 L2.1
+5_L: C44.1 C45.1 C46.1 C47.1 C48.1 DD4.16(VCC) DD5.16(VCC) DD6.16(VCC) DD7.16(VCC) DD8.16(VCC) L2.2 R233.2 R240.2 R245.2
GND: C43.2 C44.2 C45.2 C46.2 C47.2 C48.2 DD4.8(GND) DD5.8(GND) DD6.8(GND) DD7.8(GND) DD8.8(GND) R266.2 R267.2 R268.2 R273.2 R274.2
CP_to_MCU: DD4.2(CP) DD5.2(CP) DD6.2(CP) DD7.2(CP) DD8.2(CP) R221.2 R233.1
nCE_to_MCU: DD4.15(~{CE}) DD5.15(~{CE}) DD6.15(~{CE}) DD7.15(~{CE}) DD8.15(~{CE}) R228.2 R240.1
nPL_to_MCU: DD4.1(~{PL}) DD5.1(~{PL}) DD6.1(~{PL}) DD7.1(~{PL}) DD8.1(~{PL}) R222.2 R245.1
OUT_BITs: DD8.9(Q7) R220.2
NetDD4_3: DD4.3(D4) R231.1
NetDD4_4: DD4.4(D5) R224.1
NetDD4_5: DD4.5(D6) R232.1
NetDD4_6: DD4.6(D7) R225.1
NetDD4_9: DD4.9(Q7) R226.1
NetDD4_11: DD4.11(D0) R229.1
NetDD4_12: DD4.12(D1) R223.1
NetDD4_13: DD4.13(D2) R230.1
NetDD4_14: DD4.14(D3) R227.1
NetDD5_3: DD5.3(D4) R242.1
NetDD5_4: DD5.4(D5) R237.1
NetDD5_5: DD5.5(D6) R243.1
NetDD5_6: DD5.6(D7) R238.1
NetDD5_9: DD5.9(Q7) R239.1
NetDD5_10: DD5.10(DS) R234.1
NetDD5_11: DD5.11(D0) R244.1
NetDD5_12: DD5.12(D1) R235.1
NetDD5_13: DD5.13(D2) R241.1
NetDD5_14: DD5.14(D3) R236.1
NetDD6_3: DD6.3(D4) R254.1
NetDD6_4: DD6.4(D5) R249.1
NetDD6_5: DD6.5(D6) R255.1
NetDD6_6: DD6.6(D7) R250.1
NetDD6_9: DD6.9(Q7) R251.1
NetDD6_10: DD6.10(DS) R246.1
NetDD6_11: DD6.11(D0) R252.1
NetDD6_12: DD6.12(D1) R247.1
NetDD6_13: DD6.13(D2) R253.1
NetDD6_14: DD6.14(D3) R248.1
NetDD7_3: DD7.3(D4) R264.1
NetDD7_4: DD7.4(D5) R259.1
NetDD7_5: DD7.5(D6) R265.1
NetDD7_6: DD7.6(D7) R260.1
NetDD7_9: DD7.9(Q7) R261.1
NetDD7_10: DD7.10(DS) R256.1
NetDD7_11: DD7.11(D0) R262.1
NetDD7_12: DD7.12(D1) R257.1
NetDD7_13: DD7.13(D2) R263.1
NetDD7_14: DD7.14(D3) R258.1
NetDD8_3: DD8.3(D4) R273.1
NetDD8_4: DD8.4(D5) R267.1
NetDD8_5: DD8.5(D6) R274.1
NetDD8_6: DD8.6(D7) R268.1
NetDD8_10: DD8.10(DS) R269.1
NetDD8_11: DD8.11(D0) R271.1
NetDD8_12: DD8.12(D1) R270.1
NetDD8_13: DD8.13(D2) R272.1
NetDD8_14: DD8.14(D3) R266.1
NetR15_2: R265.2 ; port DI31
NetR16_2: R258.2 ; port DI28
NetR20_2: R270.2 ; port DI34
NetR31_2: R264.2 ; port DI29
NetR32_2: R260.2 ; port DI32
NetR40_2: R272.2 ; port DI35
NetR47_2: R271.2 ; port DI33
NetR48_2: R259.2 ; port DI30
NetR64_2: R229.2 ; port DI1
NetR65_2: R227.2 ; port DI4
NetR66_2: R232.2 ; port DI7
NetR82_2: R223.2 ; port DI2
NetR83_2: R231.2 ; port DI5
NetR84_2: R225.2 ; port DI8
NetR100_2: R224.2 ; port DI6
NetR101_2: R244.2 ; port DI9
NetR102_2: R230.2 ; port DI3
NetR118_2: R247.2 ; port DI18
NetR119_2: R236.2 ; port DI12
NetR120_2: R243.2 ; port DI15
NetR136_2: R235.2 ; port DI10
NetR137_2: R242.2 ; port DI13
NetR138_2: R238.2 ; port DI16
NetR154_2: R241.2 ; port DI11
NetR155_2: R237.2 ; port DI14
NetR156_2: R252.2 ; port DI17
NetR172_2: R249.2 ; port DI22
NetR173_2: R253.2 ; port DI19
NetR174_2: R262.2 ; port DI25
NetR190_2: R248.2 ; port DI20
NetR191_2: R255.2 ; port DI23
NetR192_2: R257.2 ; port DI26
NetR208_2: R254.2 ; port DI21
NetR209_2: R250.2 ; port DI24
NetR210_2: R263.2 ; port DI27
NetR220_1: R220.1 ; port Out_bit
NetR221_1: R221.1 ; port CP
NetR222_1: R222.1 ; port ~{PL}
NetR226_2: R226.2 R234.2
NetR228_1: R228.1 ; port ~{CE}
NetR239_2: R239.2 R246.2
NetR251_2: R251.2 R256.2
NetR261_2: R261.2 R269.2

Not connected (* = marked no-connect by the designer): DD4 7(~{Q7})* 10(DS)*; DD5 7(~{Q7})*; DD6 7(~{Q7})*; DD7 7(~{Q7})*; DD8 7(~{Q7})*

### Notes on the sheet
- Подп. и дата
- Инв. № дубл.
- Взам. инв. №
- Инв. № подл.
- Изм.
- Лист
- № докум.
- Подп.
- Дата
- 2.106-A3
- Копировал
- Формат А3

### Library data of the parts
C43-C48 = GRM188R71C104KA01D: Manufacturer: Murata Manufacturing; Код: 22; ID: Конденсатор; Power/Voltage: 16V; Tolerance: ±10%; TKE: X7R; iii: Конденсатор GRM188R71C104KA01D 100n 16V ±10% C0603 X7R  Murata Manufacturing; Comments: C0603; Part Number: GRM188R71C104KA01D; Height: 0.9; Package: C0603; TemperatureMin: -55; TemperatureMax: 125
DD4-DD8 = 74HC165D_BJ_: Integrated Circuit; Manufacturer_Name: Toshiba; PartNumber: 74HC165D(BJ); Datasheet Link: https://www.arrow.com/en/products/74hc165d-bj/toshiba?region=nac; Height: 1.75mm; Mouser Part Number: 757-74HC165DBJ; Mouser Price/Stock: https://www.mouser.co.uk/ProductDetail/Toshiba/74HC165DBJ?qs=lQAVKuKFhkJom8fGze1o7Q%3D%3D; Arrow Part Number: 74HC165D(BJ); Arrow Price/Stock: https://www.arrow.com/en/products/74hc165d-bj/toshiba?region=nac
L2 = BLM18PG330SN1D: as L1 on sheet 06_PWR_Inputs_12V; Com: BLM18PG330SN1D; Part Number: BLM18PG330SN1D; Package: L0603
R220-R232 R234-R239 R241-R244 R246-R265 R269-R272 = RC0603FK-0722RL: Manufacturer: Тайвань; Код: 11; ID: Резистор; Power/Voltage: 0.063W/50V; Tolerance: ±1%; iii: Резистор RC0603FK-0722RL 22 0.063W/50V ±1% R0603  Тайвань; Comments: R0603; Part Number: RC0603FK-0722RL; Package: R0603; TemperatureMin: -55; TemperatureMax: 155
R233 R240 R245 R266-R268 R273 R274 = RC0603FK-0710KL: Part Number: RC0603FR-0710KL; Manufacturer: Тайвань; Код: 26; ID: Резистор; Power/Voltage: 0.063W/50V; Tolerance: ±1%; iii: Резистор RC0603FK-0710KL 10k 0.063W/50V ±1% R0603  Тайвань; Comments: R0603; Package: R0603; TemperatureMin: -55; TemperatureMax: 155

## Sheet 09_MCU.SchDoc
size 594 x 420 mm; DocumentNumber: ATmega64A-AU; SheetNumber: 9; SheetTotal: 11
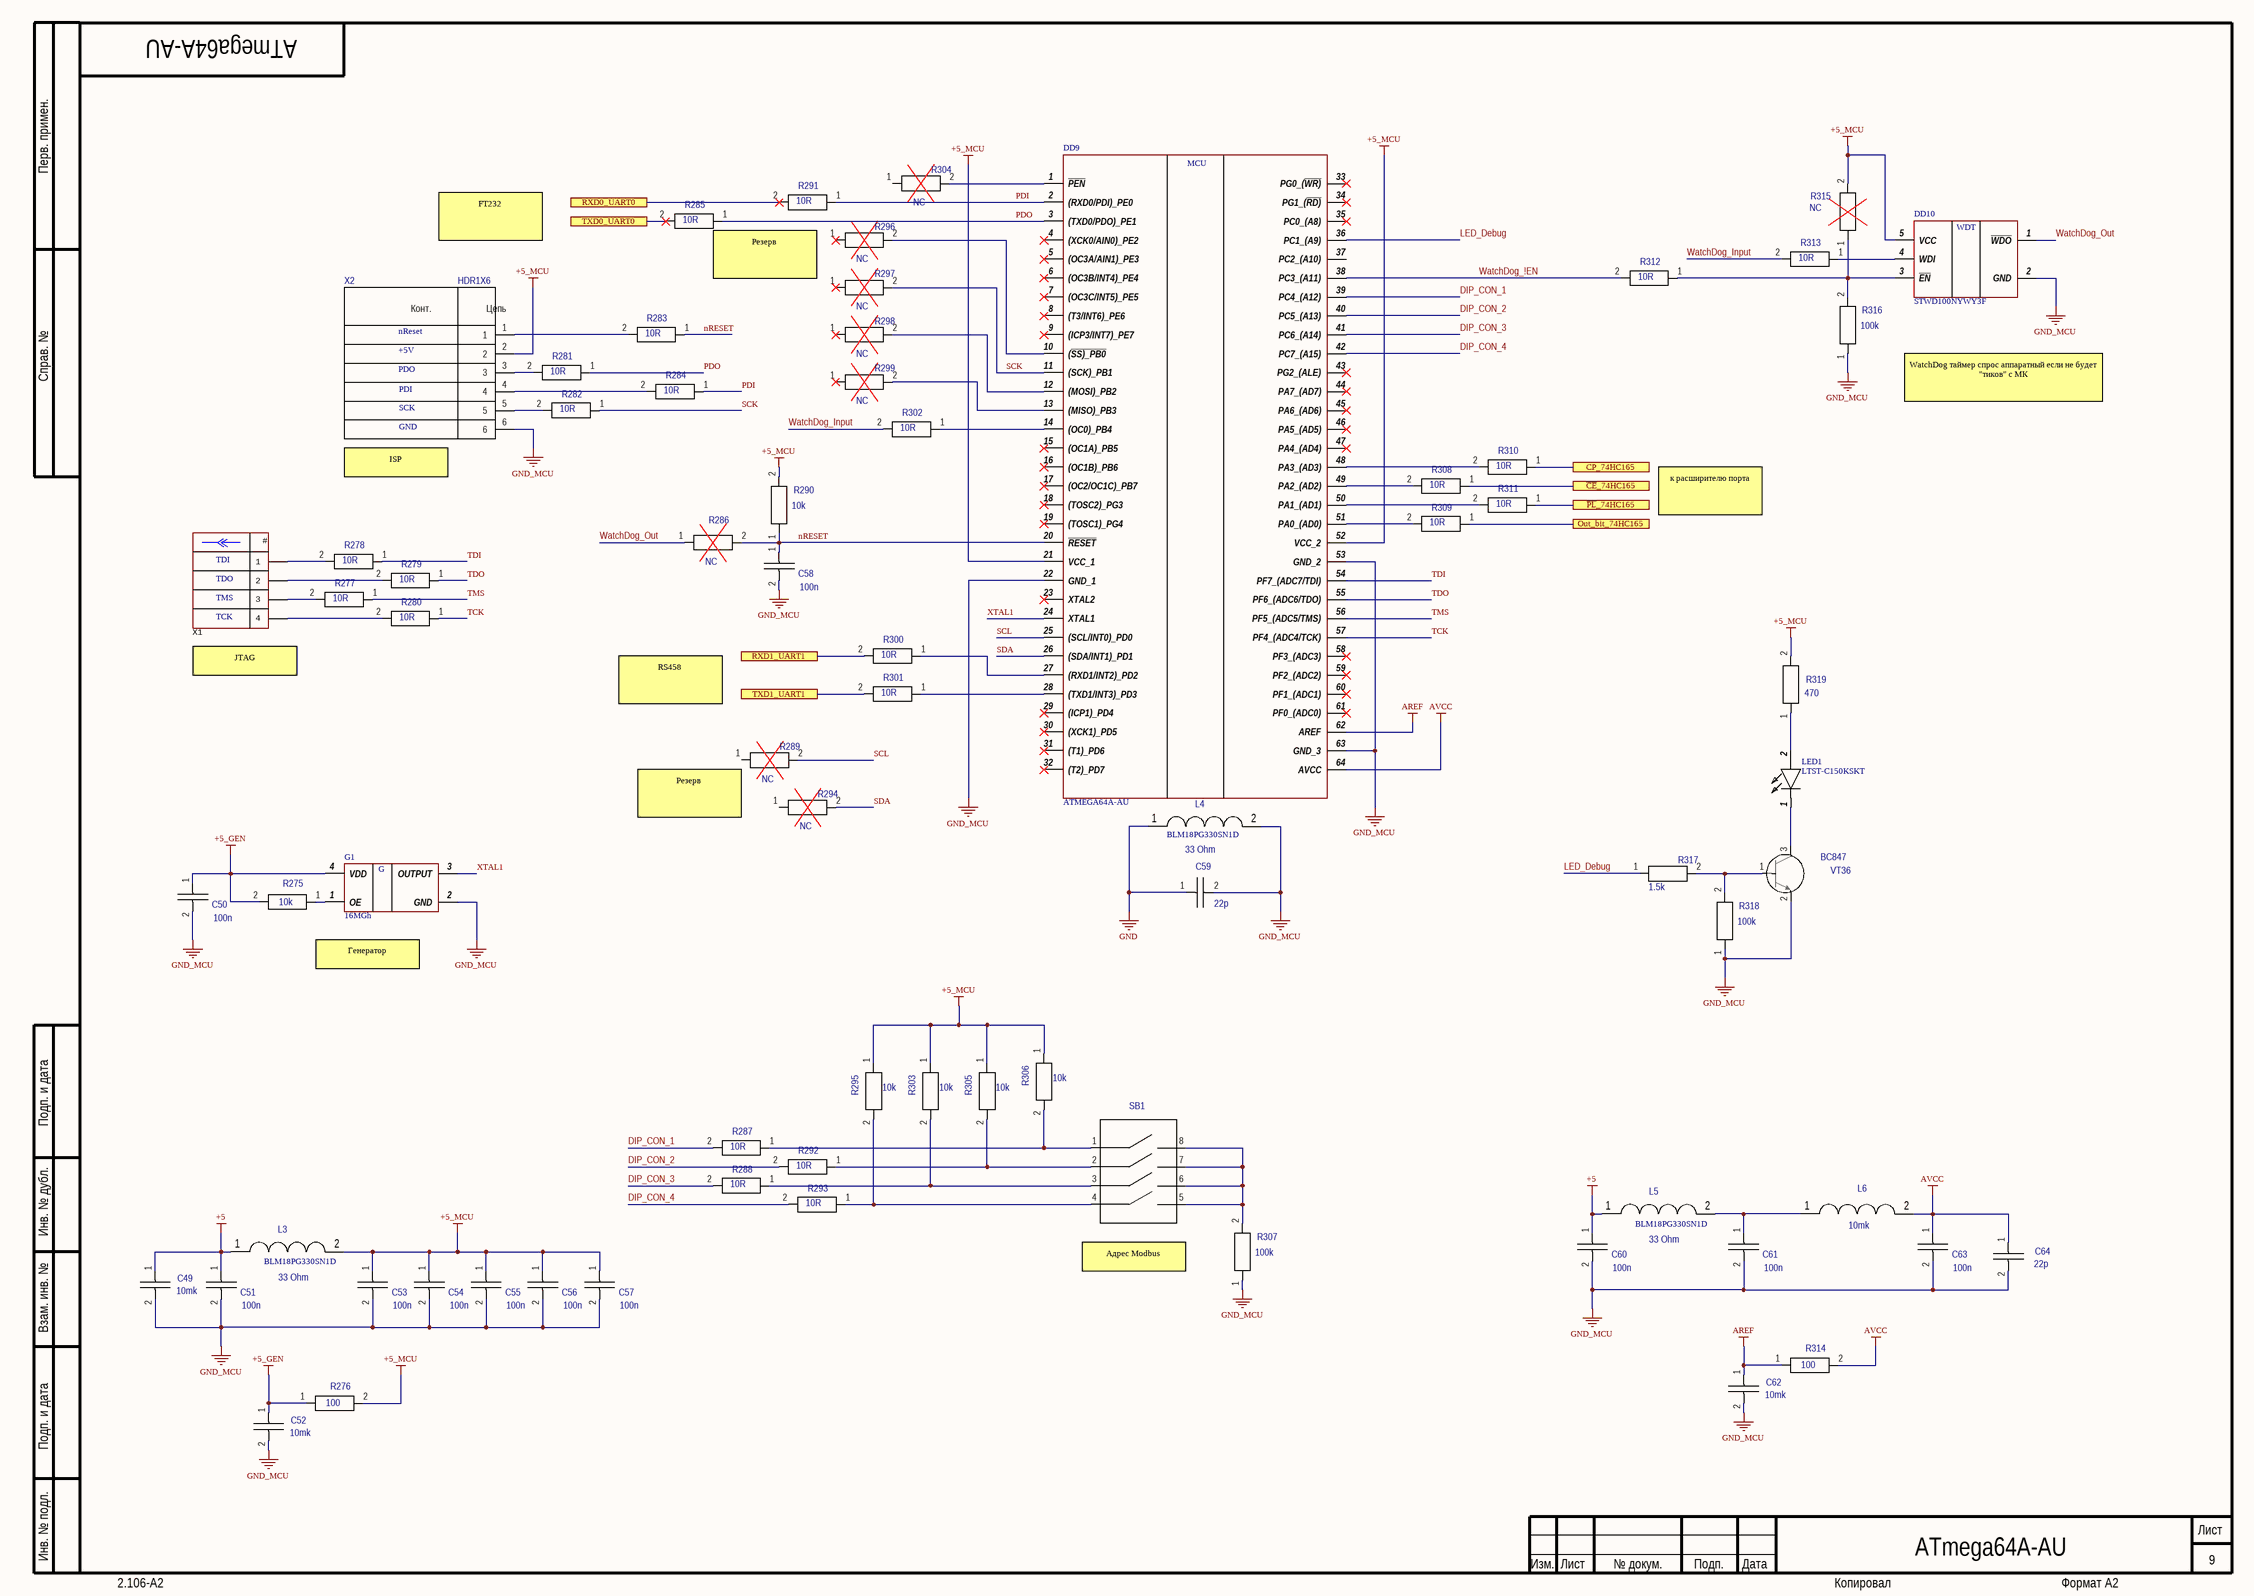
[diagram p11: 09_MCU.SchDoc]

### Parts
C49  value 10mk  [C1206]  (hidden comment: C1206)
C50  value 100n  [C0603]  (hidden comment: C0603)
C51  value 100n  [C0603]  (hidden comment: C0603)
C52  value 10mk  [C1206]  (hidden comment: C1206)
C53  value 100n  [C0603]  (hidden comment: C0603)
C54  value 100n  [C0603]  (hidden comment: C0603)
C55  value 100n  [C0603]  (hidden comment: C0603)
C56  value 100n  [C0603]  (hidden comment: C0603)
C57  value 100n  [C0603]  (hidden comment: C0603)
C58  value 100n  [C0603]  (hidden comment: C0603)
C59  value 22p  [C0603]  (hidden comment: C0603)
C60  value 100n  [C0603]  (hidden comment: C0603)
C61  value 100n  [C0603]  (hidden comment: C0603)
C62  value 10mk  [C1206]  (hidden comment: C1206)
C63  value 100n  [C0603]  (hidden comment: C0603)
C64  value 22p  [C0603]  (hidden comment: C0603)
DD9  ATMEGA64A-AU  [QFP80P1600X1600X120-64N]
DD10  STWD100NYWY3F  [SOT95P280X145-5N]
G1  16MGh  [CSX750FBC14745600T]
L3  BLM18PG330SN1D  value 33 Ohm  [INDC1608N]
L4  BLM18PG330SN1D  value 33 Ohm  [INDC1608N]
L5  BLM18PG330SN1D  value 33 Ohm  [INDC1608N]
L6  value 10mk  [INDC4532AN]  (hidden comment: L1812)
LED1  LTST-C150KSKT  [LEDC3216X110N]
R275  value 10k  [RESC1608N]  (hidden comment: R0603)
R276  value 100  [RESC1608N]  (hidden comment: R0603)
R277  value 10R  [RESC1608N]  (hidden comment: R0603)
R278  value 10R  [RESC1608N]  (hidden comment: R0603)
R279  value 10R  [RESC1608N]  (hidden comment: R0603)
R280  value 10R  [RESC1608N]  (hidden comment: R0603)
R281  value 10R  [RESC1608N]  (hidden comment: R0603)
R282  value 10R  [RESC1608N]  (hidden comment: R0603)
R283  value 10R  [RESC1608N]  (hidden comment: R0603)
R284  value 10R  [RESC1608N]  (hidden comment: R0603)
R285  value 10R  [RESC1608N]  (hidden comment: R0603)
R286  value NC  [RESC1608N]  (hidden comment: R0603)
R287  value 10R  [RESC1608N]  (hidden comment: R0603)
R288  value 10R  [RESC1608N]  (hidden comment: R0603)
R289  value NC  [RESC1608N]  (hidden comment: R0603)
R290  value 10k  [RESC1608N]  (hidden comment: R0603)
R291  value 10R  [RESC1608N]  (hidden comment: R0603)
R292  value 10R  [RESC1608N]  (hidden comment: R0603)
R293  value 10R  [RESC1608N]  (hidden comment: R0603)
R294  value NC  [RESC1608N]  (hidden comment: R0603)
R295  value 10k  [RESC1608N]  (hidden comment: R0603)
R296  value NC  [RESC1608N]  (hidden comment: R0603)
R297  value NC  [RESC1608N]  (hidden comment: R0603)
R298  value NC  [RESC1608N]  (hidden comment: R0603)
R299  value NC  [RESC1608N]  (hidden comment: R0603)
R300  value 10R  [RESC1608N]  (hidden comment: R0603)
R301  value 10R  [RESC1608N]  (hidden comment: R0603)
R302  value 10R  [RESC1608N]  (hidden comment: R0603)
R303  value 10k  [RESC1608N]  (hidden comment: R0603)
R304  value NC  [RESC1608N]  (hidden comment: R0603)
R305  value 10k  [RESC1608N]  (hidden comment: R0603)
R306  value 10k  [RESC1608N]  (hidden comment: R0603)
R307  value 100k  [RESC1608N]  (hidden comment: R0603)
R308  value 10R  [RESC1608N]  (hidden comment: R0603)
R309  value 10R  [RESC1608N]  (hidden comment: R0603)
R310  value 10R  [RESC1608N]  (hidden comment: R0603)
R311  value 10R  [RESC1608N]  (hidden comment: R0603)
R312  value 10R  [RESC1608N]  (hidden comment: R0603)
R313  value 10R  [RESC1608N]  (hidden comment: R0603)
R314  value 100  [RESC1608N]  (hidden comment: R0603)
R315  value NC  [RESC1608N]  (hidden comment: R0603)
R316  value 100k  [RESC1608N]  (hidden comment: R0603)
R317  value 1.5k  [RESC1608N]  (hidden comment: R0603)
R318  value 100k  [RESC1608N]  (hidden comment: R0603)
R319  value 470  [RESC1608N]  (hidden comment: R0603)
SB1  DS1040-04RN  [Dip_4pin]  (value not drawn)
VT36  BC847  [SOT23-3N]
X1  (no value)  [CON: PBS-4]
X2  HDR1X6  [HDR1X6]

### Ports
CP_74HC165, Out_bit_74HC165, RXD0_UART0, RXD1_UART1, TXD0_UART0, TXD1_UART1, ~{CE}_74HC165, ~{PL}_74HC165

### Nets
+5: C49.1 C51.1 C60.1 L3.1 L5.1
+5_GEN: C50.1 C52.1 G1.4(VDD) R275.2 R276.1
+5_MCU: C53.1 C54.1 C55.1 C56.1 C57.1 DD9.21(VCC_1) DD9.52(VCC_2) DD10.5(VCC) L3.2 R276.2 R290.2 R295.1 R303.1 R305.1 R306.1 R315.2 R319.2 X2.2
AREF: C62.1 DD9.62(AREF) R314.1
AVCC: C63.1 C64.1 DD9.64(AVCC) L6.2 R314.2
GND: C59.1 L4.1
GND_MCU: C49.2 C50.2 C51.2 C52.2 C53.2 C54.2 C55.2 C56.2 C57.2 C58.2 C59.2 C60.2 C61.2 C62.2 C63.2 C64.2 DD9.22(GND_1) DD9.53(GND_2) DD9.63(GND_3) DD10.2(GND) G1.2(GND) L4.2 R307.1 R316.1 R318.1 VT36.2 X2.6
DIP_CON_1: DD9.39(PC4_(A12)) R287.2
DIP_CON_2: DD9.40(PC5_(A13)) R292.2
DIP_CON_3: DD9.41(PC6_(A14)) R288.2
DIP_CON_4: DD9.42(PC7_(A15)) R293.2
LED_Debug: DD9.36(PC1_(A9)) R317.1
nRESET: C58.1 DD9.20(~{RESET}) R283.1 R286.2 R290.1
PDI: DD9.2((RXD0/PDI)_PE0) R284.1 R291.1
PDO: DD9.3((TXD0/PDO)_PE1) R281.1 R285.1
RXD: R300.2 ; port RXD1_UART1
SCK: DD9.11((SCK)_PB1) R282.1 R297.2
SCL: DD9.25((SCL/INT0)_PD0) R289.2
SDA: DD9.26((SDA/INT1)_PD1) R294.2
TCK: DD9.57(PF4_(ADC4/TCK)) R280.1
TDI: DD9.54(PF7_(ADC7/TDI)) R278.1
TDO: DD9.55(PF6_(ADC6/TDO)) R279.1
TMS: DD9.56(PF5_(ADC5/TMS)) R277.1
TXD: R301.2 ; port TXD1_UART1
WatchDog_!EN: DD9.38(PC3_(A11)) R312.2
WatchDog_Input: R302.2 R313.2
WatchDog_Out: DD10.1(~{WDO}) R286.1
XTAL1: DD9.24(XTAL1) G1.3(OUTPUT)
NetC61_1: C61.1 L5.2 L6.1
NetDD9_1: DD9.1(~{PEN}) R304.2
NetDD9_10: DD9.10((~{SS)_PB0}) R296.2
NetDD9_12: DD9.12((MOSI)_PB2) R298.2
NetDD9_13: DD9.13((MISO)_PB3) R299.2
NetDD9_14: DD9.14((OC0)_PB4) R302.1
NetDD9_27: DD9.27((RXD1/INT2)_PD2) R300.1
NetDD9_28: DD9.28((TXD1/INT3)_PD3) R301.1
NetDD9_48: DD9.48(PA3_(AD3)) R310.2
NetDD9_49: DD9.49(PA2_(AD2)) R308.2
NetDD9_50: DD9.50(PA1_(AD1)) R311.2
NetDD9_51: DD9.51(PA0_(AD0)) R309.2
NetDD10_3: DD10.3(~{EN}) R312.1 R315.1 R316.2
NetDD10_4: DD10.4(WDI) R313.1
NetG1_1: G1.1(OE) R275.1
NetLED1_1: LED1.1(K) VT36.3
NetLED1_2: LED1.2(A) R319.1
NetR220_1: R309.1 ; port Out_bit_74HC165
NetR221_1: R310.1 ; port CP_74HC165
NetR222_1: R311.1 ; port ~{PL}_74HC165
NetR228_1: R308.1 ; port ~{CE}_74HC165
NetR277_2: R277.2 X1.3
NetR278_2: R278.2 X1.1
NetR279_2: R279.2 X1.2
NetR280_2: R280.2 X1.4
NetR281_2: R281.2 X2.3
NetR282_2: R282.2 X2.5
NetR283_2: R283.2 X2.1
NetR284_2: R284.2 X2.4
NetR285_2: R285.2 ; port TXD0_UART0
NetR287_1: R287.1 R306.2 SB1.1
NetR288_1: R288.1 R303.2 SB1.3
NetR291_2: R291.2 ; port RXD0_UART0
NetR292_1: R292.1 R305.2 SB1.2
NetR293_1: R293.1 R295.2 SB1.4
NetR307_2: R307.2 SB1.5 SB1.6 SB1.7 SB1.8
NetR317_2: R317.2 R318.2 VT36.1

Not connected (* = marked no-connect by the designer): DD9 4((XCK0/AIN0)_PE2)* 5((OC3A/AIN1)_PE3)* 6((OC3B/INT4)_PE4)* 7((OC3C/INT5)_PE5)* 8((T3/INT6)_PE6)* 9((ICP3/INT7)_PE7)* 15((OC1A)_PB5)* 16((OC1B)_PB6)* 17((OC2/OC1C)_PB7)* 18((TOSC2)_PG3)* 19((TOSC1)_PG4)* 23(XTAL2)* 29((ICP1)_PD4)* 30((XCK1)_PD5)* 31((T1)_PD6)* 32((T2)_PD7)* 33(PG0_(~{WR)})* 34(PG1_(~{RD)})* 35(PC0_(A8))* 37(PC2_(A10)) 43(PG2_(ALE))* 44(PA7_(AD7))* 45(PA6_(AD6))* 46(PA5_(AD5))* 47(PA4_(AD4))* 58(PF3_(ADC3))* 59(PF2_(ADC2))* 60(PF1_(ADC1))* 61(PF0_(ADC0))*; R289 1; R294 1; R296 1*; R297 1*; R298 1*; R299 1*; R304 1

### Notes on the sheet
- FT232
- (near R285) Резерв
- nReset
- +5V
- PDO
- SCK
- PDI
- WatchDog таймер спрос аппаратный если не будет "тиков" с МК
- GND
- ISP
- к расширителю порта
- TDI
- TDO
- TMS
- TCK
- (near X1) JTAG
- RS458
- (near R289) Резерв
- Генератор
- Адрес Modbus
- Перв. примен.
- Справ. №
- Подп. и дата
- Инв. № дубл.
- Взам. инв. №
- Инв. № подл.
- Изм.
- Лист
- № докум.
- Подп.
- Дата
- 2.106-A2
- Копировал
- Формат А2
- (in symbol ATMEGA64A-AU) MCU
- (in symbol CSX-750FCC) G
- (in symbol HDR1X6) Конт.; Цепь
- (in symbol PBS-4) #
- (in symbol STWD100NYWY3F) WDT

### Library data of the parts
C49 C52 C62 = GRM31CR71E106KA12L: Manufacturer: Murata Manufacturing; Код: 62; ID: Конденсатор; Power/Voltage: 25V; Tolerance: ±10%; TKE: X7R; iii: Конденсатор GRM31CR71E106KA12L 10mk 25V ±10% C1206 X7R  Murata Manufacturing; Comments: C1206; Part Number: GRM31CR71E106KA12L; Height: 1,5; Package: C1206; TemperatureMin: -55; TemperatureMax: 125
C50 C51 C53-C58 C60 C61 C63 = GRM188R71C104KA01D: as C43-C48 on sheet 08_Extention_GPIO; Comments: C0603; Part Number: GRM188R71C104KA01D; Height: 0.9; Package: C0603; TemperatureMin: -55; TemperatureMax: 125
C59 C64 = GRM1885C1H220JA01D: as C41 on sheet 06_PWR_Inputs_12V; Comments: C0603; Part Number: GRM1885C1H220JA01D; Package: C0603; TemperatureMin: -55; TemperatureMax: 125
DD9 = ATMEGA64A-AU: Integrated Circuit; Manufacturer_Name: Microchip; Datasheet Link: https://datasheet.datasheetarchive.com/originals/distributors/Datasheets_SAMA/61cd3663d987104d1956c12d3ceac457.pdf; Height: 1.2mm; Manufacturer_Part_Number: ATMEGA64A-AU; Mouser Part Number: 556-ATMEGA64A-AU; Mouser Price/Stock: https://www.mouser.co.uk/ProductDetail/Microchip-Technology-Atmel/ATMEGA64A-AU?qs=RwPDB89%252B8xSA448I6y2Ecg%3D%3D; Part Number: ATMEGA64A-AU; Arrow Price/Stock: https://www.arrow.com/en/products/atmega64a-au/microchip-technology?region=nac
DD10 = STWD100NYWY3F: Integrated Circuit; Manufacturer_Name: STMicroelectronics; Datasheet Link: https://datasheet.datasheetarchive.com/originals/distributors/Datasheets-DGA25/1683135.pdf; Height: 1.45mm; PartNumber: STWD100NYWY3F; Mouser Part Number: 511-STWD100NYWY3F; Mouser Price/Stock: https://www.mouser.co.uk/ProductDetail/STMicroelectronics/STWD100NYWY3F?qs=jWm4idrLpzx15dHtESXwMQ%3D%3D; Arrow Part Number: STWD100NYWY3F; Arrow Price/Stock: https://www.arrow.com/en/products/stwd100nywy3f/stmicroelectronics?region=nac
G1 = CSX-750FCC: Кварцевый генератор 16МГц 5В,HCMOS/TTL в корпусе SMD 7x5мм; гк 16000 \\SMD07050C4\T/CM\5В\ CSX-750FCC\CITIZEN; Manufacturer_Name: Citizen Finetech Miyota; Datasheet Link: https://www.chipdip.ru/product0/8004482821; Height: 1.6mm; Manufacturer_Part_Number: CSX-750FCC; PartNumber: CSX-750FCC; Mouser Price/Stock: https://www.chipdip.ru/product0/8004482821
L3-L5 = BLM18PG330SN1D: as L1 on sheet 06_PWR_Inputs_12V; Com: BLM18PG330SN1D; Part Number: BLM18PG330SN1D; Package: L0603
L6 = B82432-A1103-K: Manufacturer: Epcos; Код: 16; ID: Индуктивность; Tolerance: ±10%; iii: Индуктивность B82432-A1103-K 10mk  ±10% L1812  Epcos; Com: L1812; Part Number: B82432-A1103-K; Package: L1812
LED1 = LTST-C150KSKT: LED; Manufacturer_Name: Lite-On; Datasheet Link: https://componentsearchengine.com/Datasheets/1/LTST-C150KSKT.pdf; Height: 1.1mm; Manufacturer_Part_Number: LTST-C150KSKT; Mouser Part Number: 859-LTST-C150KSKT; Mouser Price/Stock: https://www.mouser.co.uk/ProductDetail/Lite-On/LTST-C150KSKT?qs=BwFLjhzUaKkzXUKRSgwLjg%3D%3D; Arrow Part Number: LTST-C150KSKT; Arrow Price/Stock: https://www.arrow.com/en/products/ltst-c150kskt/lite-on-technology?region=nac
R275 R290 R295 R303 R305 R306 = RC0603FK-0710KL: Manufacturer: Тайвань; Код: 26; ID: Резистор; Power/Voltage: 0.063W/50V; Tolerance: ±1%; iii: Резистор RC0603FK-0710KL 10k 0.063W/50V ±1% R0603  Тайвань; Comments: R0603; Part Number: RC0603FK-0710KL; Package: R0603; TemperatureMin: -55; TemperatureMax: 155
R276 R314 = RC0603FK-07100RL: Manufacturer: Тайвань; Код: 16; ID: Резистор; Power/Voltage: 0.063W/50V; Tolerance: ±1%; iii: Резистор RC0603FK-07100RL 100 0.063W/50V ±1% R0603  Тайвань; Comments: R0603; Part Number: RC0603FK-07100RL; Package: R0603; TemperatureMin: -55; TemperatureMax: 155
R277-R285 R287 R288 R291-R293 R300-R302 R308-R313 = RC0603FK-0710KL: Part Number: RC0603FR-0710RL; Manufacturer: Тайвань; Код: 26; ID: Резистор; Power/Voltage: 0.063W/50V; Tolerance: ±1%; iii: Резистор RC0603FK-0710KL 10k 0.063W/50V ±1% R0603  Тайвань; Comments: R0603; Package: R0603; TemperatureMin: -55; TemperatureMax: 155
R286 R289 R294 R296-R299 R304 R315 = 0603_NC: Код: 274; iii: NC 0603_NC NC   R0603; Comments: R0603; ID: NC; Part Number: 0603_NC; Package: R0603
R307 R316 R318 = RC0603FK-07100KL: Manufacturer: Тайвань; Код: 24; ID: Резистор; Power/Voltage: 0.063W/50V; Tolerance: ±1%; iii: Резистор RC0603FK-07100KL 100k 0.063W/50V ±1% R0603  Тайвань; Comments: R0603; Part Number: RC0603FK-07100KL; Package: R0603; TemperatureMin: -55; TemperatureMax: 155
R317 = RC0603FK-071K5L: Manufacturer: Тайвань; Код: 22; ID: Резистор; Power/Voltage: 0.063W/50V; Tolerance: ±1%; iii: Резистор RC0603FK-071K5L 1.5k 0.063W/50V ±1% R0603  Тайвань; Comments: R0603; Part Number: RC0603FK-071K5L; Package: R0603; TemperatureMin: -55; TemperatureMax: 155
R319 = RC0603FK-07470RL: Manufacturer: Тайвань; Код: 20; ID: Резистор; Power/Voltage: 0.063W/50V; Tolerance: ±1%; iii: Резистор RC0603FK-07470RL 470 0.063W/50V ±1% R0603  Тайвань; Comments: R0603; Part Number: RC0603FK-07470RL; Package: R0603; TemperatureMin: -55; TemperatureMax: 155
SB1 = DS1040-04RN: Код: 51; ID: Переключатель DIP; iii: Переключатель DIP DS1040-04RN; Part Number: DS1040-04RN
VT36 = BC847: Manufacturer: NXP Semiconductor; Код: 2; ID: Транзистор; Value: 0.1A; Power/Voltage: 45V; iii: Транзистор BC847 0.1A 45V  sot23  NXP Semiconductor; Com: BC847; Part Number: BC847; Package: sot23
X1 = PBS-4: Manufacturer: Connfly; ValueManufacturerPartNumber: Connector, 4pin, 2.54mm, 500VAC, 3A; TypeConnector: Connector; VoltageMax: 500VAC; Pitch: 2.54mm; CurrentMax: 3A; Multichannel: 4pin; CommentText: "Разъем"; HelpURL: https://www.chipdip.ru/product/pbs-4; PartNumber: PBS-4
X2 = HDR1X6: Manufacturer: Dinkle Enterprise; Код: 13; ID: Коннектор; iii: Коннектор HDR1X6      Dinkle Enterprise; Part Number: HDR1X6

## Sheet 10_Connectors.SchDoc
size 420 x 297 mm; DocumentNumber: 15EDGVC-3.5-10P; SheetNumber: 10; SheetTotal: 11
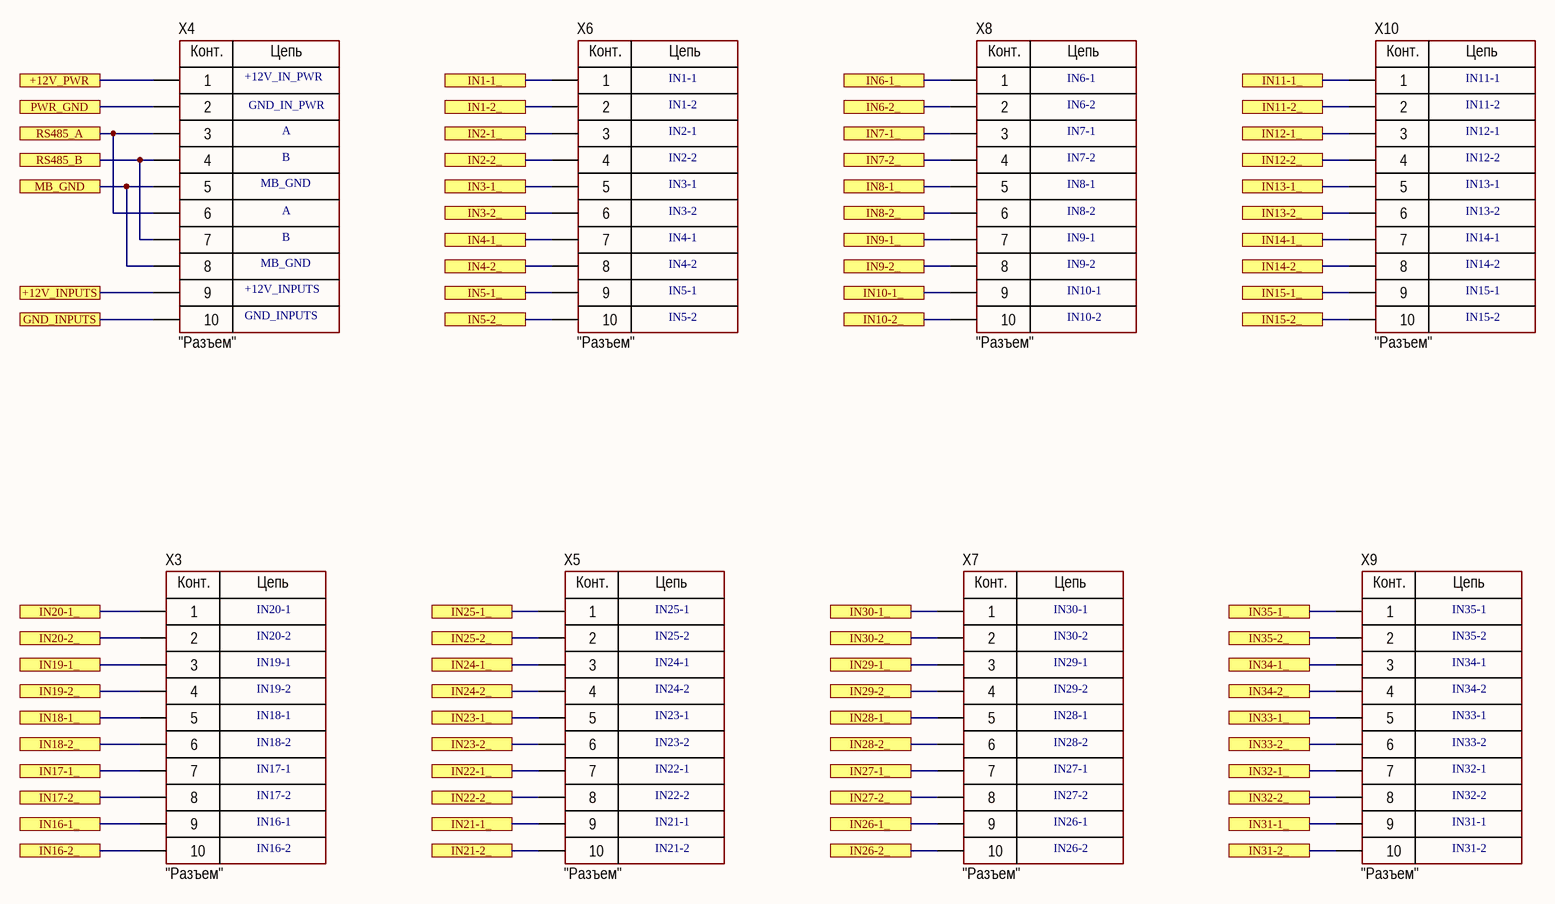
[diagram p12: 10_Connectors.SchDoc]

### Parts
X3  CommentText: "Разъем"  [CON: 15EDGVC-3.5-10P-14-00AH]
X4  CommentText: "Разъем"  [CON: 15EDGVC-3.5-10P-14-00AH]
X5  CommentText: "Разъем"  [CON: 15EDGVC-3.5-10P-14-00AH]
X6  CommentText: "Разъем"  [CON: 15EDGVC-3.5-10P-14-00AH]
X7  CommentText: "Разъем"  [CON: 15EDGVC-3.5-10P-14-00AH]
X8  CommentText: "Разъем"  [CON: 15EDGVC-3.5-10P-14-00AH]
X9  CommentText: "Разъем"  [CON: 15EDGVC-3.5-10P-14-00AH]
X10  CommentText: "Разъем"  [CON: 15EDGVC-3.5-10P-14-00AH]

### Ports
+12V_INPUTS, +12V_PWR, GND_INPUTS, IN1-1_, IN1-2_, IN2-1_, IN2-2_, IN3-1_, IN3-2_, IN4-1_, IN4-2_, IN5-1_, IN5-2_, IN6-1_, IN6-2_, IN7-1_, IN7-2_, IN8-1_, IN8-2_, IN9-1_, IN9-2_, IN10-1_, IN10-2_, IN11-1_, IN11-2_, IN12-1_, IN12-2_, IN13-1_, IN13-2_, IN14-1_, IN14-2_, IN15-1_, IN15-2_, IN16-1_, IN16-2_, IN17-1_, IN17-2_, IN18-1_, IN18-2_, IN19-1_, IN19-2_, IN20-1_, IN20-2_, IN21-1_, IN21-2_, IN22-1_, IN22-2_, IN23-1_, IN23-2_, IN24-1_, IN24-2_, IN25-1_, IN25-2_, IN26-1_, IN26-2_, IN27-1_, IN27-2_, IN28-1_, IN28-2_, IN29-1_, IN29-2_, IN30-1_, IN30-2_, IN31-1_, IN31-2_, IN32-1_, IN32-2_, IN33-1_, IN33-2_, IN34-1_, IN34-2_, IN35-1_, IN35-2_, MB_GND, PWR_GND, RS485_A, RS485_B

### Nets
1: X6.1 ; port IN1-1_
2: X6.2 ; port IN1-2_
3: X6.3 ; port IN2-1_
4: X6.4 ; port IN2-2_
5: X6.5 ; port IN3-1_
6: X6.6 ; port IN3-2_
7: X6.7 ; port IN4-1_
8: X6.8 ; port IN4-2_
9: X6.9 ; port IN5-1_
10: X6.10 ; port IN5-2_
11: X8.1 ; port IN6-1_
12: X8.2 ; port IN6-2_
13: X8.3 ; port IN7-1_
14: X8.4 ; port IN7-2_
15: X8.5 ; port IN8-1_
16: X8.6 ; port IN8-2_
17: X8.7 ; port IN9-1_
18: X8.8 ; port IN9-2_
19: X8.9 ; port IN10-1_
20: X8.10 ; port IN10-2_
21: X10.1 ; port IN11-1_
22: X10.2 ; port IN11-2_
23: X10.3 ; port IN12-1_
24: X10.4 ; port IN12-2_
25: X10.5 ; port IN13-1_
26: X10.6 ; port IN13-2_
27: X10.7 ; port IN14-1_
28: X10.8 ; port IN14-2_
29: X10.9 ; port IN15-1_
30: X10.10 ; port IN15-2_
31: X3.9 ; port IN16-1_
32: X3.10 ; port IN16-2_
33: X3.7 ; port IN17-1_
34: X3.8 ; port IN17-2_
35: X3.5 ; port IN18-1_
36: X3.6 ; port IN18-2_
37: X3.3 ; port IN19-1_
38: X3.4 ; port IN19-2_
39: X3.1 ; port IN20-1_
40: X3.2 ; port IN20-2_
41: X5.9 ; port IN21-1_
42: X5.10 ; port IN21-2_
43: X5.7 ; port IN22-1_
44: X5.8 ; port IN22-2_
45: X5.5 ; port IN23-1_
46: X5.6 ; port IN23-2_
47: X5.3 ; port IN24-1_
48: X5.4 ; port IN24-2_
49: X5.1 ; port IN25-1_
50: X5.2 ; port IN25-2_
51: X7.9 ; port IN26-1_
52: X7.10 ; port IN26-2_
53: X7.7 ; port IN27-1_
54: X7.8 ; port IN27-2_
55: X7.5 ; port IN28-1_
56: X7.6 ; port IN28-2_
57: X7.3 ; port IN29-1_
58: X7.4 ; port IN29-2_
59: X7.1 ; port IN30-1_
60: X7.2 ; port IN30-2_
61: X9.9 ; port IN31-1_
62: X9.10 ; port IN31-2_
63: X9.7 ; port IN32-1_
64: X9.8 ; port IN32-2_
65: X9.5 ; port IN33-1_
66: X9.6 ; port IN33-2_
67: X9.3 ; port IN34-1_
68: X9.4 ; port IN34-2_
69: X9.1 ; port IN35-1_
70: X9.2 ; port IN35-2_
71: X4.3 X4.6 ; port RS485_A
72: X4.4 X4.7 ; port RS485_B
73: X4.5 X4.8 ; port MB_GND
74: X4.9 ; port +12V_INPUTS
75: X4.10 ; port GND_INPUTS
76: X4.1 ; port +12V_PWR
77: X4.2 ; port PWR_GND

### Notes on the sheet
- +12V_IN_PWR
- GND_IN_PWR
- IN1-1
- IN1-2
- IN6-1
- IN6-2
- IN11-1
- IN11-2
- A
- B
- IN2-1
- IN2-2
- IN7-1
- IN7-2
- IN12-1
- IN12-2
- MB_GND
- IN3-1
- IN3-2
- IN4-1
- IN8-1
- IN8-2
- IN9-1
- IN13-1
- IN13-2
- IN14-1
- +12V_INPUTS
- GND_INPUTS
- IN4-2
- IN5-1
- IN9-2
- IN10-1
- IN14-2
- IN15-1
- IN5-2
- IN10-2
- IN15-2
- IN20-1
- IN20-2
- IN25-1
- IN25-2
- IN30-1
- IN30-2
- IN35-1
- IN35-2
- IN18-1
- IN19-1
- IN19-2
- IN23-1
- IN24-1
- IN24-2
- IN28-1
- IN29-1
- IN29-2
- IN33-1
- IN34-1
- IN34-2
- IN17-1
- IN18-2
- IN22-1
- IN23-2
- IN27-1
- IN28-2
- IN32-1
- IN33-2
- IN16-1
- IN16-2
- IN17-2
- IN21-1
- IN21-2
- IN22-2
- IN26-1
- IN26-2
- IN27-2
- IN31-1
- IN31-2
- IN32-2
- Подп. и дата
- Инв. № дубл.
- Взам. инв. №
- Инв. № подл.
- Изм.
- Лист
- № докум.
- Подп.
- Дата
- 2.106-A3
- Копировал
- Формат А3
- (in symbol 15EDGVC-3.5-10P-14-00A(H)) Конт.; Цепь

### Library data of the parts
X3-X10 = 15EDGVC-3.5-10P-14-00A(H): Manufacturer: Degson; ValueManufacturerPartNumber: Terminal connector, 6pin, 3.5mm, 300VAC, 10A; TypeConnector: Terminal connector; VoltageMax: 300VAC; Pitch: 3.5mm; CurrentMax: 10A; Multichannel: 6pin; PartNumber: 15EDGVC-3.5-10P-14-00A(H)

## Sheet 11_PWR_SYS.SchDoc
size 420 x 297 mm; DocumentNumber: LM2596S-5.0; SheetNumber: 11; SheetTotal: 11
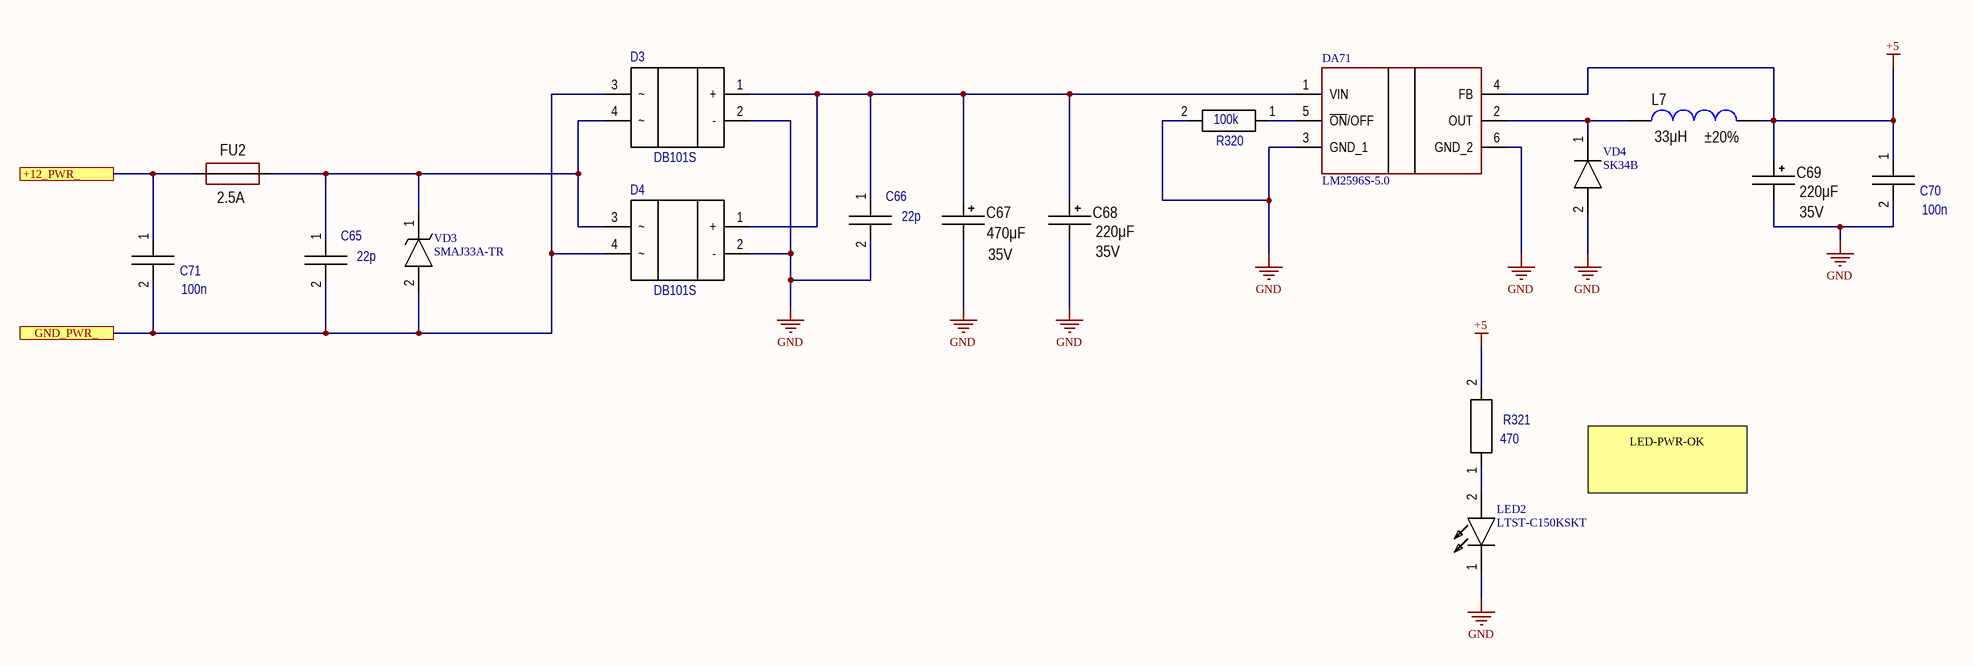
[diagram p13: 11_PWR_SYS.SchDoc]

### Parts
C65  value 22p  [C0603]  (hidden comment: C0603)
C66  value 22p  [C0603]  (hidden comment: C0603)
C67  value 470μF  Voltage: 35V  [CAP: D10C5H16]
C68  value 220μF  Voltage: 35V  [CAP: D8C3.5H12]
C69  value 220μF  Voltage: 35V  [CAP: D8C3.5H12]
C70  value 100n  [C0603]  (hidden comment: C0603)
C71  value 100n  [C0603]  (hidden comment: C0603)
D3  DB101S  [DB-1S]
D4  DB101S  [DB-1S]
DA71  LM2596S-5.0  [KTT0005B]
FU2  MaxCurrent: 2.5A  [FUSE: 1206]
L7  value 33μH  Tolerance: ±20%  [INDPM102100X400N]
LED2  LTST-C150KSKT  [LEDC3216X110N]
R320  value 100k  [RESC1608N]  (hidden comment: R0603)
R321  value 470  [RESC1608N]  (hidden comment: R0603)
VD3  SMAJ33A-TR  [SM4T82AY]
VD4  SK34B  [DIOM5236X261N]

### Ports
+12_PWR_, GND_PWR_

### Nets
+5: C69.1 C70.1 DA71.4(FB) L7.1 R321.2
GND: C66.2 C67.2 C68.2 C69.2 C70.2 D3.2(-) D4.2(-) DA71.3(GND_1) DA71.6(GND_2) LED2.1(K) R320.2 VD4.2(A)
76: C71.1 FU2.1 ; port +12_PWR_
77: C65.2 C71.2 D3.3 D4.4 VD3.2(A) ; port GND_PWR_
NetC65_1: C65.1 D3.4 D4.3 FU2.2 VD3.1(K)
NetC66_1: C66.1 C67.1 C68.1 D3.1(+) D4.1(+) DA71.1(VIN)
NetDA71_2: DA71.2(OUT) L7.2 VD4.1(K)
NetDA71_5: DA71.5(~{ON}/OFF) R320.1
NetLED2_2: LED2.2(A) R321.1

### Notes on the sheet
- LED-PWR-OK
- Подп. и дата
- Инв. № дубл.
- Взам. инв. №
- Инв. № подл.
- Изм.
- Лист
- № докум.
- Подп.
- Дата
- 2.106-A3
- Копировал
- Формат А3

### Library data of the parts
C65 C66 = GRM1885C1H220JA01D: as C41 on sheet 06_PWR_Inputs_12V; Comments: C0603; Part Number: GRM1885C1H220JA01D; Package: C0603; TemperatureMin: -55; TemperatureMax: 125
C67 = Capacitors_Aluminium: ECAP (К50-35), 470мкФ, 35В, 105°C, 20%, 10x17мм P:5мм; Manufacturer: JB Capacitors; PartNumber: JRB1V471M05001000170000B; ValueManufacturerPartNumber: Aluminium capacitor, 470μF, 35V, ±20%, 54mOhm, D10H17P5, -55...+105°C; TypeCapacitor: Aluminium capacitor; Impedance: 54mOhm; Package: D10H17P5; Temperature: -55...+105°C; Tolerance: ±20%
C68 C69 = Capacitors_Aluminium: ECAP (К50-35), 220мкФ, 35В, 105°C, 20%, 8x12мм P:3.5мм, Конденсатор электролитический алюминиевый; Manufacturer: JB Capacitors; PartNumber: JRB1V221M03500800120000B; ValueManufacturerPartNumber: Aluminium capacitor, 220μF, 35V, ±20%, 54mOhm, D8C3.5H12, -55...+105°C; TypeCapacitor: Aluminium capacitor; Impedance: 54mOhm; Package: D8C3.5H12; Temperature: -55...+105°C; Tolerance: ±20%
C70 C71 = GRM188R71C104KA01D: as C43-C48 on sheet 08_Extention_GPIO; Comments: C0603; Part Number: GRM188R71C104KA01D; Height: 0.9; Package: C0603; TemperatureMin: -55; TemperatureMax: 125
D3 D4 = DB101S: as D2 on sheet 06_PWR_Inputs_12V; Com: DB101S; Part Number: DB101S; ComponentLink1Description: Datasheet; ComponentLink1URL: \\server_altium\ServerShare\Schematic\pdf\DB101S.pdf; TemperatureMin: -55; TemperatureMax: 150
DA71 = LM2596S-5.0: Integrated Circuit; Manufacturer_Name: Texas Instruments; Datasheet Link: https://www.ti.com/lit/gpn/LM2596; PartNumber: LM2596S-5.0; Mouser Part Number: 926-LM2596S-50; Mouser Price/Stock: https://www.mouser.co.uk/ProductDetail/Texas-Instruments/LM2596S-5.0?qs=X1J7HmVL2ZGcOr96VNr%252B%2Fw%3D%3D; Arrow Part Number: LM2596S-5.0; Arrow Price/Stock: https://www.arrow.com/en/products/lm2596s-5.0/texas-instruments?region=nac
FU2 = Fuse: Manufacturer: 046602.5NR; VoltageMax: 13; Package: 1206; ValueManufacturerPartNumber: =TypeFuse+', '+VoltageMax+', '+MaxCurrent+', '+Package+', '+Temperature; PartNumber: 046602.5NR
L7 = Inductor_: CDRH104RNP-330NC; Manufacturer: Sumida; ValueManufacturerPartNumber: Fixed inductor, 33μH, ±20%, CDRH104RNP-330NC, 2.2A, -55...+125°C; TypeInductor: Fixed inductor; MaxCurrent: 2.2A; PartNumber: CDRH104RNP-330NC; Package: CDRH104RNP-330NC; Temperature: -55...+125°C
LED2 = LTST-C150KSKT: LED; Manufacturer_Name: Lite-On; Datasheet Link: https://componentsearchengine.com/Datasheets/1/LTST-C150KSKT.pdf; Height: 1.1mm; Manufacturer_Part_Number: LTST-C150KSKT; Mouser Part Number: 859-LTST-C150KSKT; Mouser Price/Stock: https://www.mouser.co.uk/ProductDetail/Lite-On/LTST-C150KSKT?qs=BwFLjhzUaKkzXUKRSgwLjg%3D%3D; Arrow Part Number: LTST-C150KSKT; Arrow Price/Stock: https://www.arrow.com/en/products/ltst-c150kskt/lite-on-technology?region=nac
R320 = RC0603FK-07100KL: as R307 on sheet 09_MCU; Comments: R0603; Part Number: RC0603FK-07100KL; Package: R0603; TemperatureMin: -55; TemperatureMax: 155
R321 = RC0603FK-07470RL: as R319 on sheet 09_MCU; Comments: R0603; Part Number: RC0603FK-07470RL; Package: R0603; TemperatureMin: -55; TemperatureMax: 155
VD3 = SMAJ33A-TR: as VD2 on sheet 06_PWR_Inputs_12V; Datasheet Link: https://www.st.com/resource/en/datasheet/smaj10ca.pdf; Height: 2.65mm; PartNumber: SMAJ33A-TR; Mouser Part Number: 511-SMAJ33A-TR; Mouser Price/Stock: https://www.mouser.co.uk/ProductDetail/STMicroelectronics/SMAJ33A-TR?qs=jwZhmErakJAmVBO%2Fr9%252BXpg%3D%3D; Arrow Part Number: SMAJ33A-TR; Arrow Price/Stock: https://www.arrow.com/en/products/smaj33a-tr/stmicroelectronics?region=europe
VD4 = SK34B: Diode; Manufacturer_Name: Taiwan Semiconductor; PartNumber: SK34; Datasheet Link: https://componentsearchengine.com/Datasheets/2/SK34B.pdf; Height: 2.61mm; Mouser Part Number: 821-SK34B; Mouser Price/Stock: https://www.mouser.co.uk/ProductDetail/Taiwan-Semiconductor/SK34B?qs=tHU%2FlV7kTyScurMVJgLz7Q%3D%3D